# EAGLE design mainboard (EAGLE 6.1)

## Sheet 1 of 2
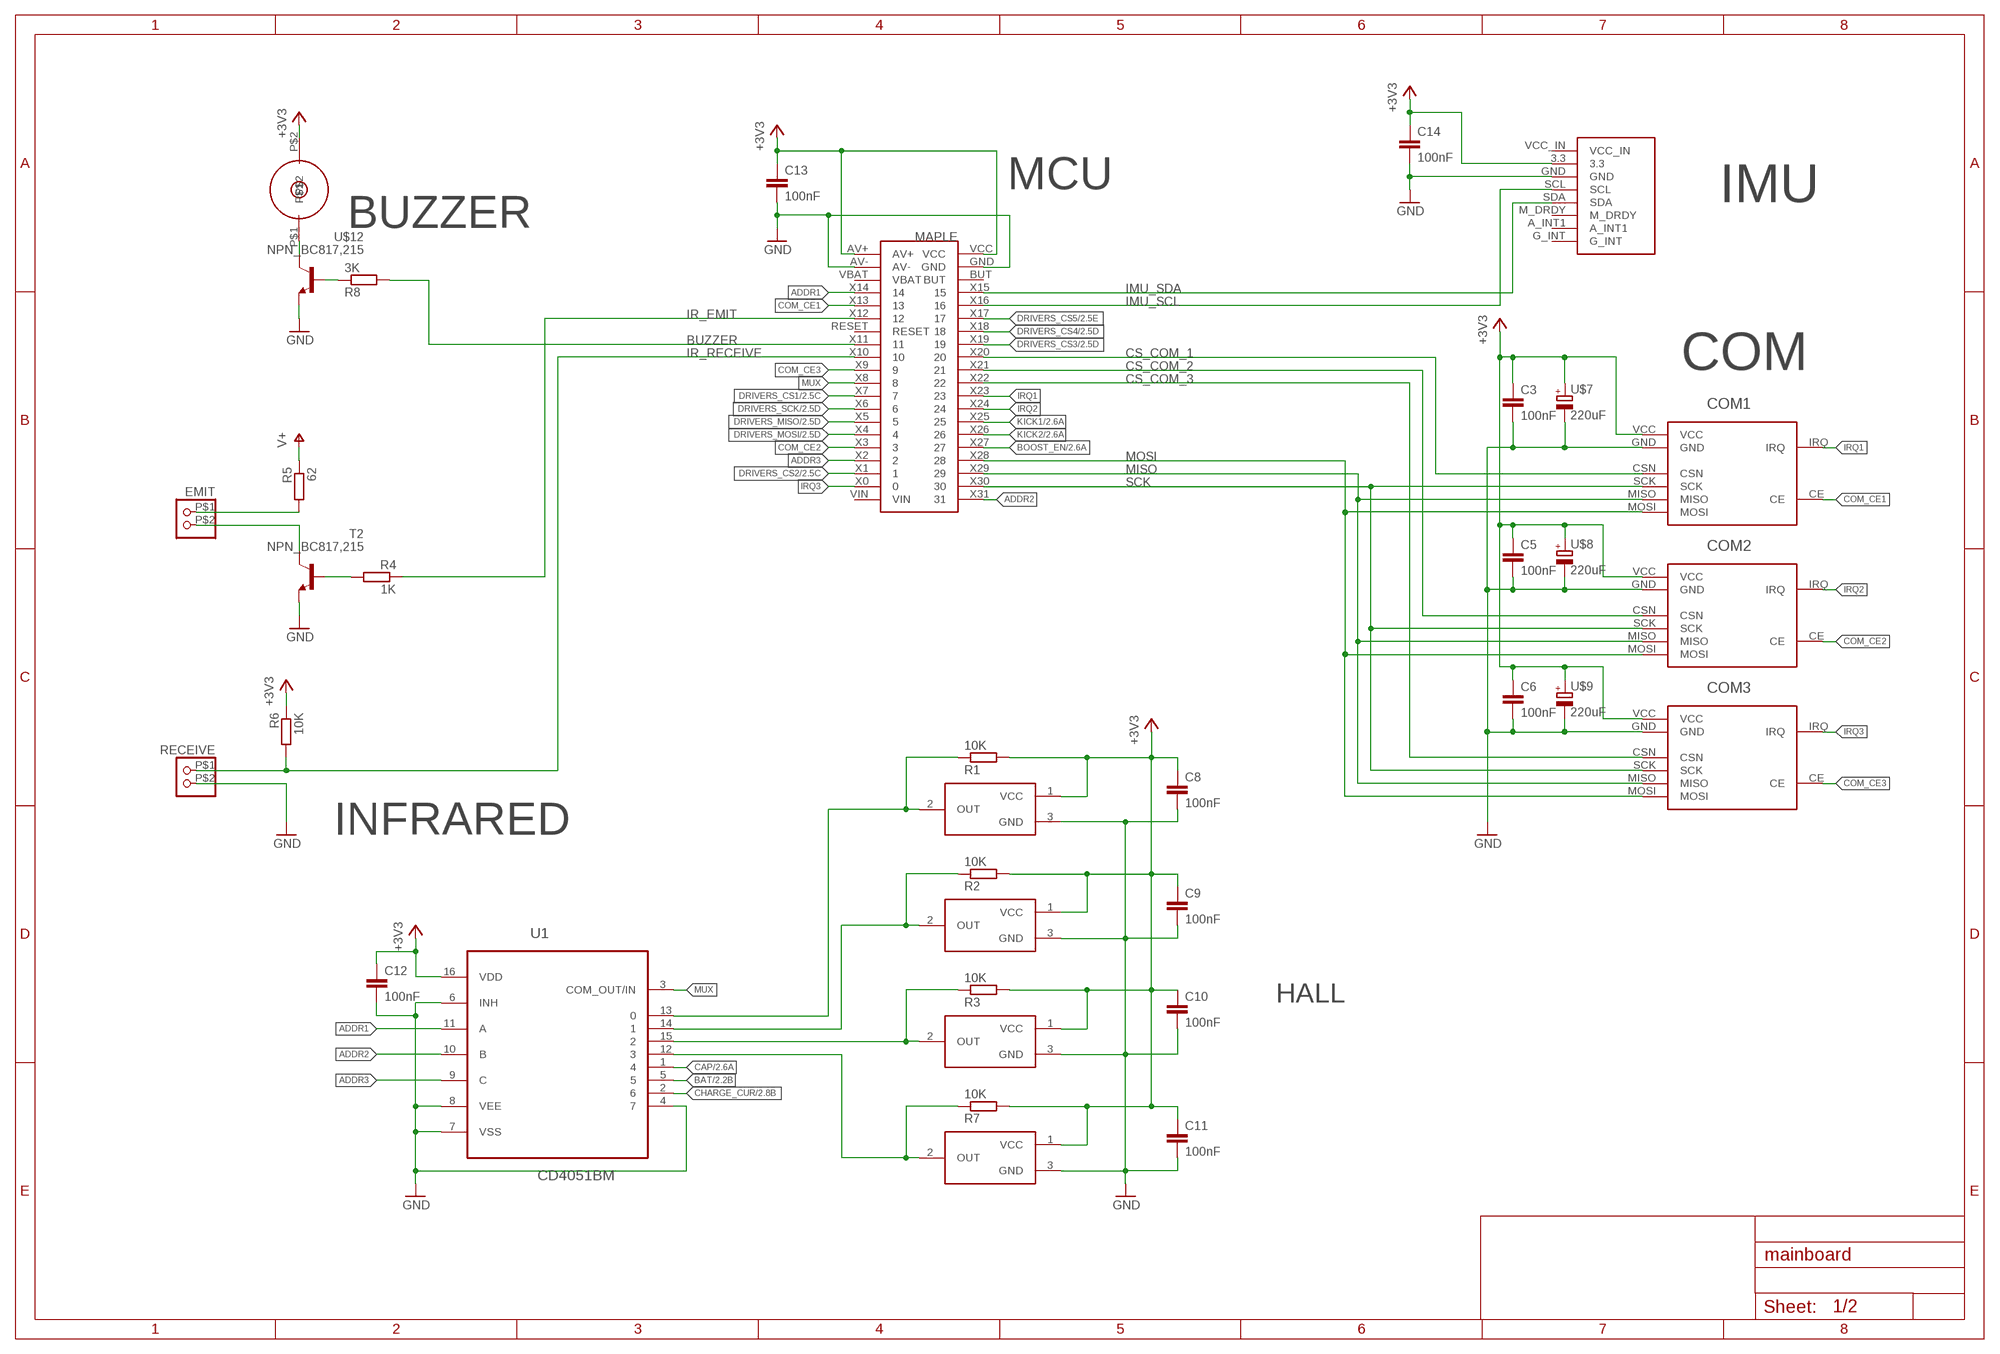
[diagram p0: schematic, sheet 1]

### Parts
C3  100nF  CAP0805  [0805@1]
C5  100nF  CAP0805  [0805@1]
C6  100nF  CAP0805  [0805@1]
C8  100nF  CAP0805  [0805@1]
C9  100nF  CAP0805  [0805@1]
C10  100nF  CAP0805  [0805@1]
C11  100nF  CAP0805  [0805@1]
C12  100nF  CAP0805  [0805@1]
C13  100nF  CAP0805  [0805@1]
C14  100nF  CAP0805  [0805@1]
COM1  NRF24L01  [NRF24L01]
COM2  NRF24L01  [NRF24L01]
COM3  NRF24L01  [NRF24L01]
EMIT  CONNEC_1X02JST-ZH  [JST_ZH_2P]
MAPLE  MAPLE_MINI  [CONNEC_2X20]
R1  10K  RESISTANCE-R0805  [R0805]
R2  10K  RESISTANCE-R0805  [R0805]
R3  10K  RESISTANCE-R0805  [R0805]
R4  1K  RESISTANCE-R0805  [R0805]
R5  62  RESISTANCE-R0805  [R0805]
R6  10K  RESISTANCE-R0805  [R0805]
R7  10K  RESISTANCE-R0805  [R0805]
R8  3K  R-EU_R0805  [R0805]
RECEIVE  CONNEC_1X02JST-ZH  [JST_ZH_2P]
T2  NPN_BC817,215  [SOT-23]
U1  CD4051BM  [SOIC127P600X175-16N]
U$1  DRV5023FAEDBZRQ1  [SOT-23]
U$2  GY-85  [GY-85]
U$5  DRV5023FAEDBZRQ1  [SOT-23]
U$7  220uF  CPOL_EUPANASONIC_D8  [PANASONIC_D8]
U$8  220uF  CPOL_EUPANASONIC_D8  [PANASONIC_D8]
U$9  220uF  CPOL_EUPANASONIC_D8  [PANASONIC_D8]
U$10  DRV5023FAEDBZRQ1  [SOT-23]
U$11  DRV5023FAEDBZRQ1  [SOT-23]
U$12  NPN_BC817,215  [SOT-23]
U$13  BUZZER66  [BUZZER66]

### Nets
+3V3: C3.1 C5.1 C6.1 C8.1 C9.1 C10.1 C11.1 C12.1 C13.1 C14.1 COM1.VCC COM2.VCC COM3.VCC MAPLE.AV+ MAPLE.VCC R1.2 R2.2 R3.2 R6.1 R7.2 U1.16(VDD) U$1.1(VCC) U$2.3.3 U$5.1(VCC) U$7.+ U$8.+ U$9.+ U$10.1(VCC) U$11.1(VCC) U$13.P$2 ; also sheet 2
ADDR1: MAPLE.X14 U1.11(A)
ADDR2: MAPLE.X31 U1.10(B)
ADDR3: MAPLE.X2 U1.9(C)
BAT: U1.5 ; also sheet 2
BOOST_EN: MAPLE.X27 ; also sheet 2
BUZZER: MAPLE.X11 R8.2
CAP: U1.1 ; also sheet 2
CHARGE_CUR: U1.2 ; also sheet 2
COM_CE1: COM1.CE MAPLE.X13
COM_CE2: COM2.CE MAPLE.X3
COM_CE3: COM3.CE MAPLE.X9
CS_COM_1: COM1.CSN MAPLE.X20
CS_COM_2: COM2.CSN MAPLE.X21
CS_COM_3: COM3.CSN MAPLE.X22
DRIVERS_CS1: MAPLE.X7 ; also sheet 2
DRIVERS_CS2: MAPLE.X1 ; also sheet 2
DRIVERS_CS3: MAPLE.X19 ; also sheet 2
DRIVERS_CS4: MAPLE.X18 ; also sheet 2
DRIVERS_CS5: MAPLE.X17 ; also sheet 2
DRIVERS_MISO: MAPLE.X5 ; also sheet 2
DRIVERS_MOSI: MAPLE.X4 ; also sheet 2
DRIVERS_SCK: MAPLE.X6 ; also sheet 2
GND [alim_big]: C3.2 C5.2 C6.2 C8.2 C9.2 C10.2 C11.2 C12.2 C13.2 C14.2 COM1.GND COM2.GND COM3.GND MAPLE.AV- MAPLE.GND RECEIVE.P$2 T2.2(E) U1.4 U1.6(INH) U1.7(VSS) U1.8(VEE) U$1.3(GND) U$2.GND U$5.3(GND) U$7.- U$8.- U$9.- U$10.3(GND) U$11.3(GND) U$12.2(E) ; also sheet 2
HALL1: R1.1 U1.13 U$1.2(OUT)
HALL2: R2.1 U1.14 U$5.2(OUT)
HALL3: R3.1 U1.15 U$10.2(OUT)
HALL4: R7.1 U1.12 U$11.2(OUT)
IMU_SCL: MAPLE.X16 U$2.SCL
IMU_SDA: MAPLE.X15 U$2.SDA
IR_EMIT: MAPLE.X12 R4.1
IR_RECEIVE: MAPLE.X10 R6.2 RECEIVE.P$1
IRQ1: COM1.IRQ MAPLE.X23
IRQ2: COM2.IRQ MAPLE.X24
IRQ3: COM3.IRQ MAPLE.X0
KICK1: MAPLE.X25 ; also sheet 2
KICK2: MAPLE.X26 ; also sheet 2
MISO: COM1.MISO COM2.MISO COM3.MISO MAPLE.X29
MOSI: COM1.MOSI COM2.MOSI COM3.MOSI MAPLE.X28
MUX: MAPLE.X8 U1.3(COM_OUT/IN)
N$3: R8.1 U$12.1(B)
N$5: U$12.3(C) U$13.P$1
N$6: EMIT.P$1 R5.2
N$7: EMIT.P$2 T2.3(C)
N$11: R4.2 T2.1(B)
SCK: COM1.SCK COM2.SCK COM3.SCK MAPLE.X30
V+ [alim_small]: R5.1 ; also sheet 2
Unconnected: MAPLE.BUT MAPLE.RESET MAPLE.VBAT MAPLE.VIN U$2.A_INT1 U$2.G_INT U$2.M_DRDY U$2.VCC_IN

### Notes on the sheet
- MCU | IMU
- BUZZER
- COM
- INFRARED
- HALL

## Sheet 2 of 2
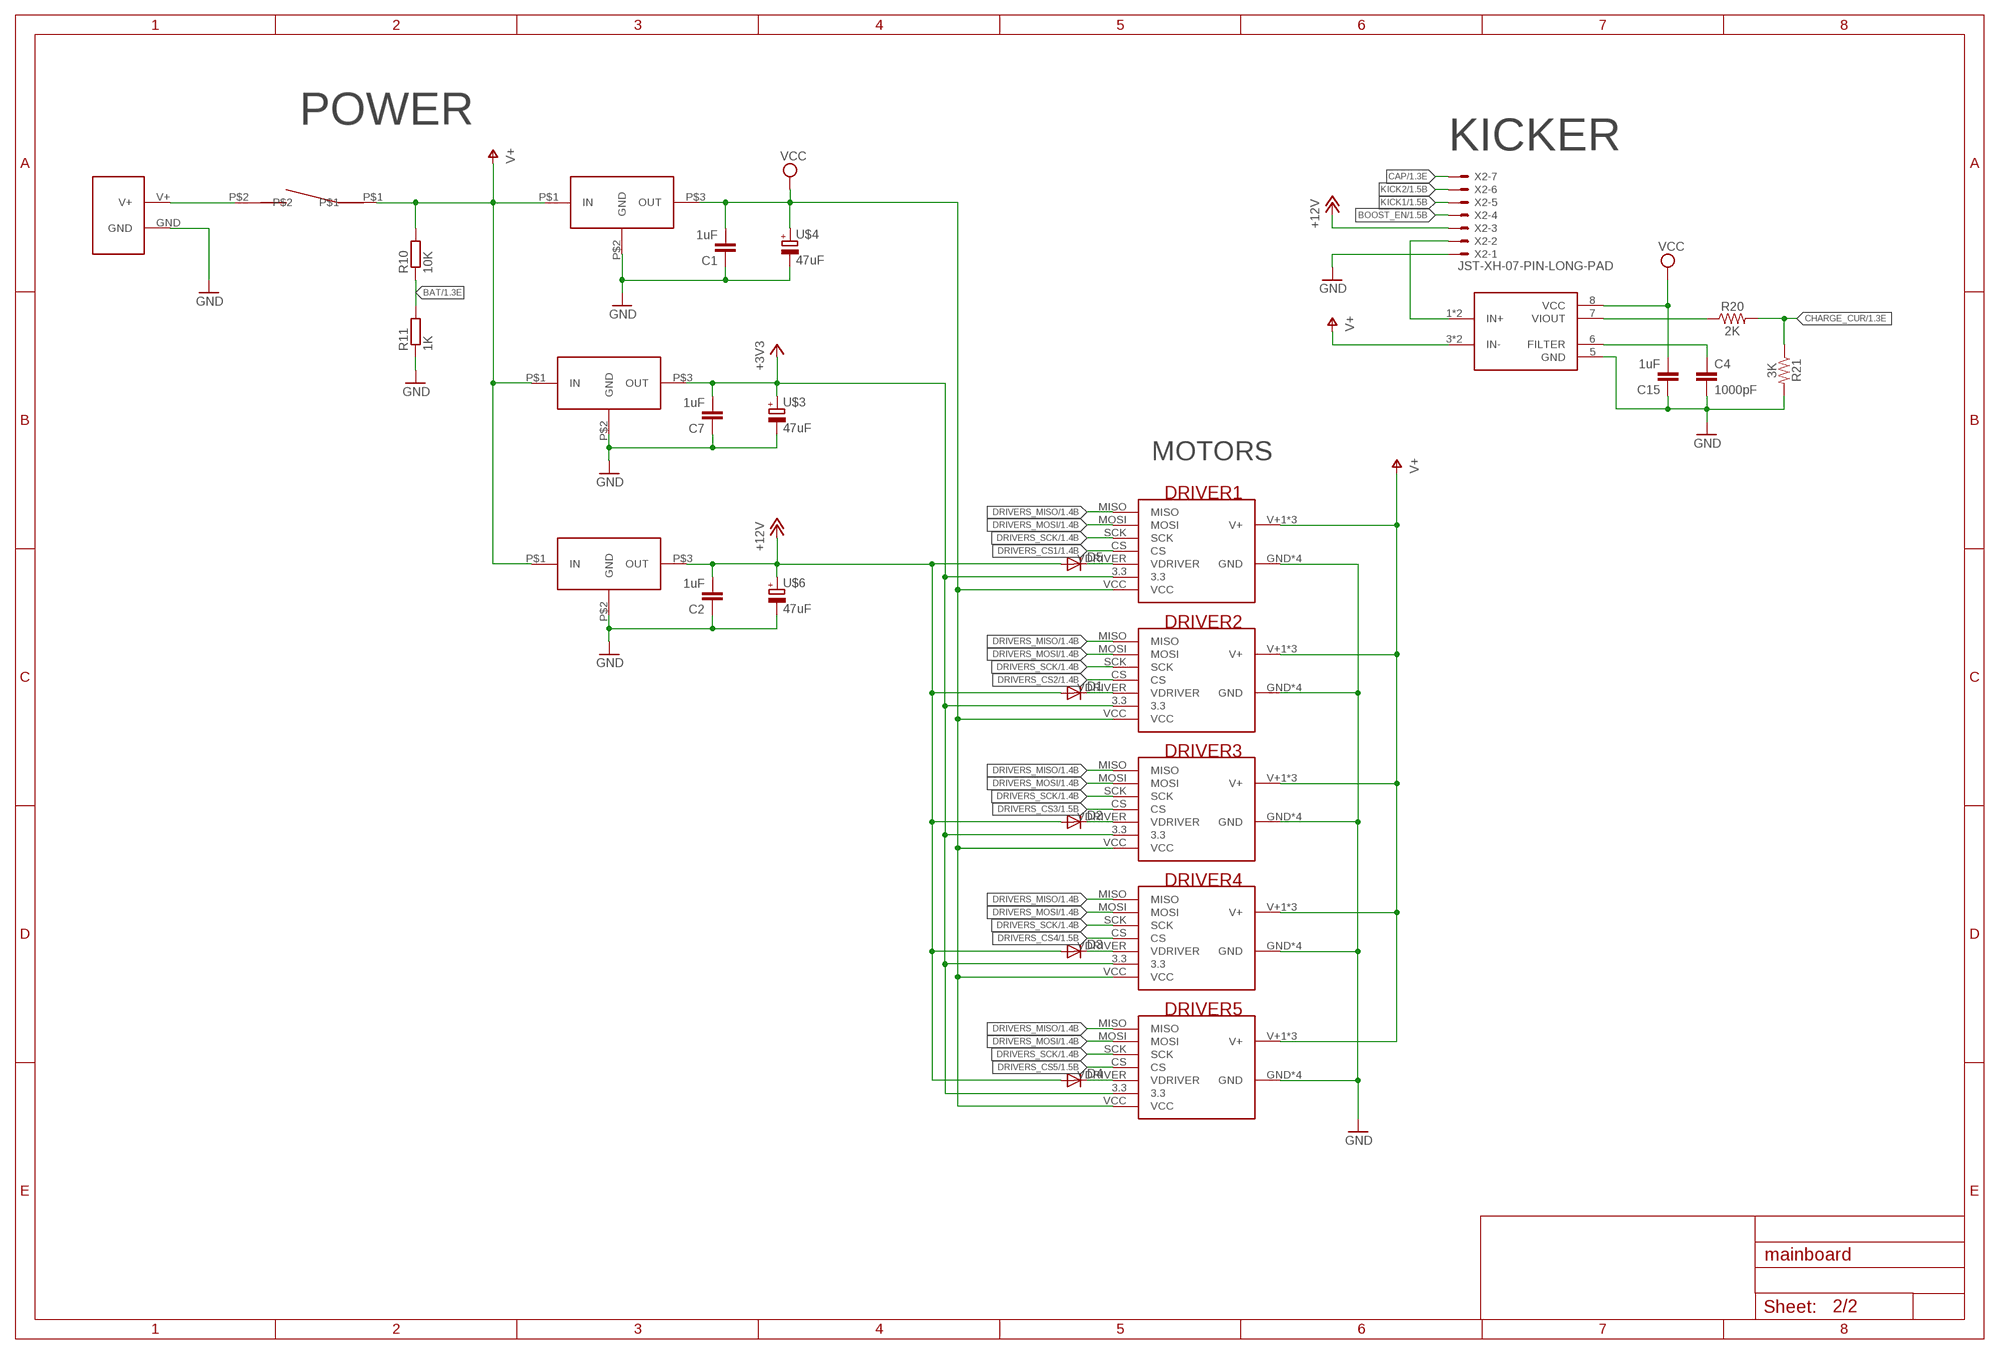
[diagram p1: schematic, sheet 2]

### Parts
C1  1uF  CAP0805  [0805@1]
C2  1uF  CAP0805  [0805@1]
C4  1000pF  CAP0805  [0805@1]
C7  1uF  CAP0805  [0805@1]
C15  1uF  CAP0805  [0805@1]
D1  DIODESOD  [SOD-323]
D2  DIODESOD  [SOD-323]
D3  DIODESOD  [SOD-323]
D4  DIODESOD  [SOD-323]
D5  DIODESOD  [SOD-323]
DRIVER1  RHOBAN_BL_DRIVER  [RHOBAN_BL_DRIVER]
DRIVER2  RHOBAN_BL_DRIVER  [RHOBAN_BL_DRIVER]
DRIVER3  RHOBAN_BL_DRIVER  [RHOBAN_BL_DRIVER]
DRIVER4  RHOBAN_BL_DRIVER  [RHOBAN_BL_DRIVER]
DRIVER5  RHOBAN_BL_DRIVER  [RHOBAN_BL_DRIVER]
R10  10K  RESISTANCE-R0805  [R0805]
R11  1K  RESISTANCE-R0805  [R0805]
R20  2K  RESISTOR0805  [0805]
R21  3K  RESISTOR0805  [0805]
REG3.3V  REG_5V  [TRACOPOWER]
REG3.3V1  REG_5V  [TRACOPOWER]
REG5V  REG_5V  [TRACOPOWER]
SENSE  ACS712  [SO8]
U$3  47uF  CPOL_EUPANASONIC_D  [PANASONIC_D]
U$4  47uF  CPOL_EUPANASONIC_D  [PANASONIC_D]
U$6  47uF  CPOL_EUPANASONIC_D  [PANASONIC_D]
U$15  SRB22A2FBBNN  [SRB22A2FBBNN]
X2  JST-XH-07-PIN-LONG-PAD  [JST-XH-07-PACKAGE-LONG-PAD]
XT60  CONNEC_ALIM  [XT60]

### Nets
+3V3: C7.2 DRIVER1.3.3 DRIVER2.3.3 DRIVER3.3.3 DRIVER4.3.3 DRIVER5.3.3 REG3.3V.P$3(OUT) U$3.+ ; also sheet 1
+12V: C2.2 D1.2(A) D2.2(A) D3.2(A) D4.2(A) D5.2(A) REG3.3V1.P$3(OUT) U$6.+ X2.3
BAT: R10.1 R11.2 ; also sheet 1
BOOST_EN: X2.4 ; also sheet 1
CAP: X2.7 ; also sheet 1
CHARGE_CUR: R20.2 R21.1 ; also sheet 1
DRIVERS_CS1: DRIVER1.CS ; also sheet 1
DRIVERS_CS2: DRIVER2.CS ; also sheet 1
DRIVERS_CS3: DRIVER3.CS ; also sheet 1
DRIVERS_CS4: DRIVER4.CS ; also sheet 1
DRIVERS_CS5: DRIVER5.CS ; also sheet 1
DRIVERS_MISO: DRIVER1.MISO DRIVER2.MISO DRIVER3.MISO DRIVER4.MISO DRIVER5.MISO ; also sheet 1
DRIVERS_MOSI: DRIVER1.MOSI DRIVER2.MOSI DRIVER3.MOSI DRIVER4.MOSI DRIVER5.MOSI ; also sheet 1
DRIVERS_SCK: DRIVER1.SCK DRIVER2.SCK DRIVER3.SCK DRIVER4.SCK DRIVER5.SCK ; also sheet 1
GND [alim_big]: C1.1 C2.1 C4.2 C7.1 C15.1 DRIVER1.GND DRIVER1.GND2(GND) DRIVER1.GND3(GND) DRIVER1.GND4(GND) DRIVER2.GND DRIVER2.GND2(GND) DRIVER2.GND3(GND) DRIVER2.GND4(GND) DRIVER3.GND DRIVER3.GND2(GND) DRIVER3.GND3(GND) DRIVER3.GND4(GND) DRIVER4.GND DRIVER4.GND2(GND) DRIVER4.GND3(GND) DRIVER4.GND4(GND) DRIVER5.GND DRIVER5.GND2(GND) DRIVER5.GND3(GND) DRIVER5.GND4(GND) R11.1 R21.2 REG3.3V1.P$2(GND) REG3.3V.P$2(GND) REG5V.P$2(GND) SENSE.5(GND) U$3.- U$4.- U$6.- X2.1 XT60.GND ; also sheet 1
KICK1: X2.5 ; also sheet 1
KICK2: X2.6 ; also sheet 1
N$1: U$15.P$2 XT60.V+
N$2: C4.1 SENSE.6(FILTER)
N$4: SENSE.1(IN+) SENSE.2(IN+) X2.2
N$8: D5.1(C) DRIVER1.VDRIVER
N$9: D3.1(C) DRIVER4.VDRIVER
N$10: D4.1(C) DRIVER5.VDRIVER
N$12: D2.1(C) DRIVER3.VDRIVER
N$13: D1.1(C) DRIVER2.VDRIVER
N$24: R20.1 SENSE.7(VIOUT)
V+ [alim_small]: DRIVER1.V+1(V+) DRIVER1.V+2(V+) DRIVER1.V+3(V+) DRIVER2.V+1(V+) DRIVER2.V+2(V+) DRIVER2.V+3(V+) DRIVER3.V+1(V+) DRIVER3.V+2(V+) DRIVER3.V+3(V+) DRIVER4.V+1(V+) DRIVER4.V+2(V+) DRIVER4.V+3(V+) DRIVER5.V+1(V+) DRIVER5.V+2(V+) DRIVER5.V+3(V+) R10.2 REG3.3V1.P$1(IN) REG3.3V.P$1(IN) REG5V.P$1(IN) SENSE.3(IN-) SENSE.4(IN-) U$15.P$1 ; also sheet 1
VCC [alim_small]: C1.2 C15.2 DRIVER1.VCC DRIVER2.VCC DRIVER3.VCC DRIVER4.VCC DRIVER5.VCC REG5V.P$3(OUT) SENSE.8(VCC) U$4.+

### Notes on the sheet
- POWER
- KICKER
- MOTORS

## Library data of the parts
C1-C3 C5-C15 = SparkFun-Passives:CAP: Capacitor Standard 0603 ceramic capacitor, and 0.1" leaded capacitor.; FARNELL: 2496946
C4 = SparkFun-Passives:CAP: Capacitor Standard 0603 ceramic capacitor, and 0.1" leaded capacitor.; FARNELL: 2496935
COM1-COM3 = rhoban:NRF24L01; FARNELL: 1668343
D1-D5 = SparkFun-DiscreteSemi:DIODE: Diode These are standard reverse protection diodes and small signal diodes. SMA package can handle up to about 1A. SOD-323 can handle about 200mA. What the SOD-323 package when ordering, there are some mfgs out there that are 5-pin packages.; FARNELL: 8737843RL
DRIVER1-DRIVER5 = rhoban:RHOBAN_BL_DRIVER; FARNELL: 1593459,1593459,1593463
EMIT = rhoban:CONNEC_1X02; FARNELL: 1212763
MAPLE = rhoban:MAPLE_MINI; FARNELL: 1593469,1593469
R1-R3 R6 R7 R10 = rhoban:RESISTANCE: RESISTOR, European symbol; FARNELL: 2447553
R4 R11 = rhoban:RESISTANCE: RESISTOR, European symbol; FARNELL: 2446904
R5 = rhoban:RESISTANCE: RESISTOR, European symbol; FARNELL: 2138819
R8 = rcl:R-EU_: RESISTOR, European symbol; FARNELL: 2446965
R20 = SparkFun-Resistors:RESISTOR: Generic Resistor Package; FARNELL: 2446939
R21 = SparkFun-Resistors:RESISTOR: Generic Resistor Package; FARNELL: 2446965
RECEIVE = rhoban:CONNEC_1X02; FARNELL: 3152856
REG3.3V = rhoban:REG_5V; FARNELL: 1696319
REG3.3V1 = rhoban:REG_5V; FARNELL: 1672130
REG5V = rhoban:REG_5V; FARNELL: 1696320
SENSE = rhoban:ACS712; FARNELL: 1329623
T2 U$12 = rhoban:NPN; FARNELL: 1081223
U1 = rhoban:CD4051BM: CMOS Analog Multiplexers/Demultiplexers with Logic Level Conversion; FARNELL: 2334931; MPN: CD4051BM; OC_FARNELL: 8388970; OC_NEWARK: 05B5595; PACKAGE: SOIC-16; SUPPLIER: Texas Instruments
U$1 U$5 U$10 U$11 = rhoban:DRV5023FAEDBZRQ1; FARNELL: 2673327RL
U$2 = rhoban:GY-85; FARNELL: 1593463
U$3 U$4 U$6 = rhoban:CPOL_EU: 47uF: http://fr.farnell.com/panasonic-electronic-components/eee1ca470sp/condensateur-elec-alu-47uf-16v/dp/9696946 220uF: http://fr.farnell.com/panasonic-electronic-components/eeefk1c221xp/condensateur-elec-alu-220uf-16v/dp/1850103; FARNELL: 9696946
U$7-U$9 = rhoban:CPOL_EU: 47uF: http://fr.farnell.com/panasonic-electronic-components/eee1ca470sp/condensateur-elec-alu-47uf-16v/dp/9696946 220uF: http://fr.farnell.com/panasonic-electronic-components/eeefk1c221xp/condensateur-elec-alu-220uf-16v/dp/1850103; FARNELL: 1850103
U$13 = rhoban:BUZZER; FARNELL: -
U$15 = rhoban:SRB22A2FBBNN; FARNELL: 1383947
X2 = Rembrandt Electronics - JST XH Connectors v1-0:JST-XH-07-PIN: JST XH Connector 2 Pin Wire to board connector. Pitch: 2,54 mm, (0.100") Number of pins: 7 Created by Rembrandt Electronics www.rembrandtelectronics.com
XT60 = rhoban:CONNEC_ALIM; FARNELL: -

## Net classes
0 default: width 0.254 mm
1 alim_small: width 0.508 mm
2 alim_big: width 0.508 mm
3 alim_very_big: width 0.508 mm

## Board
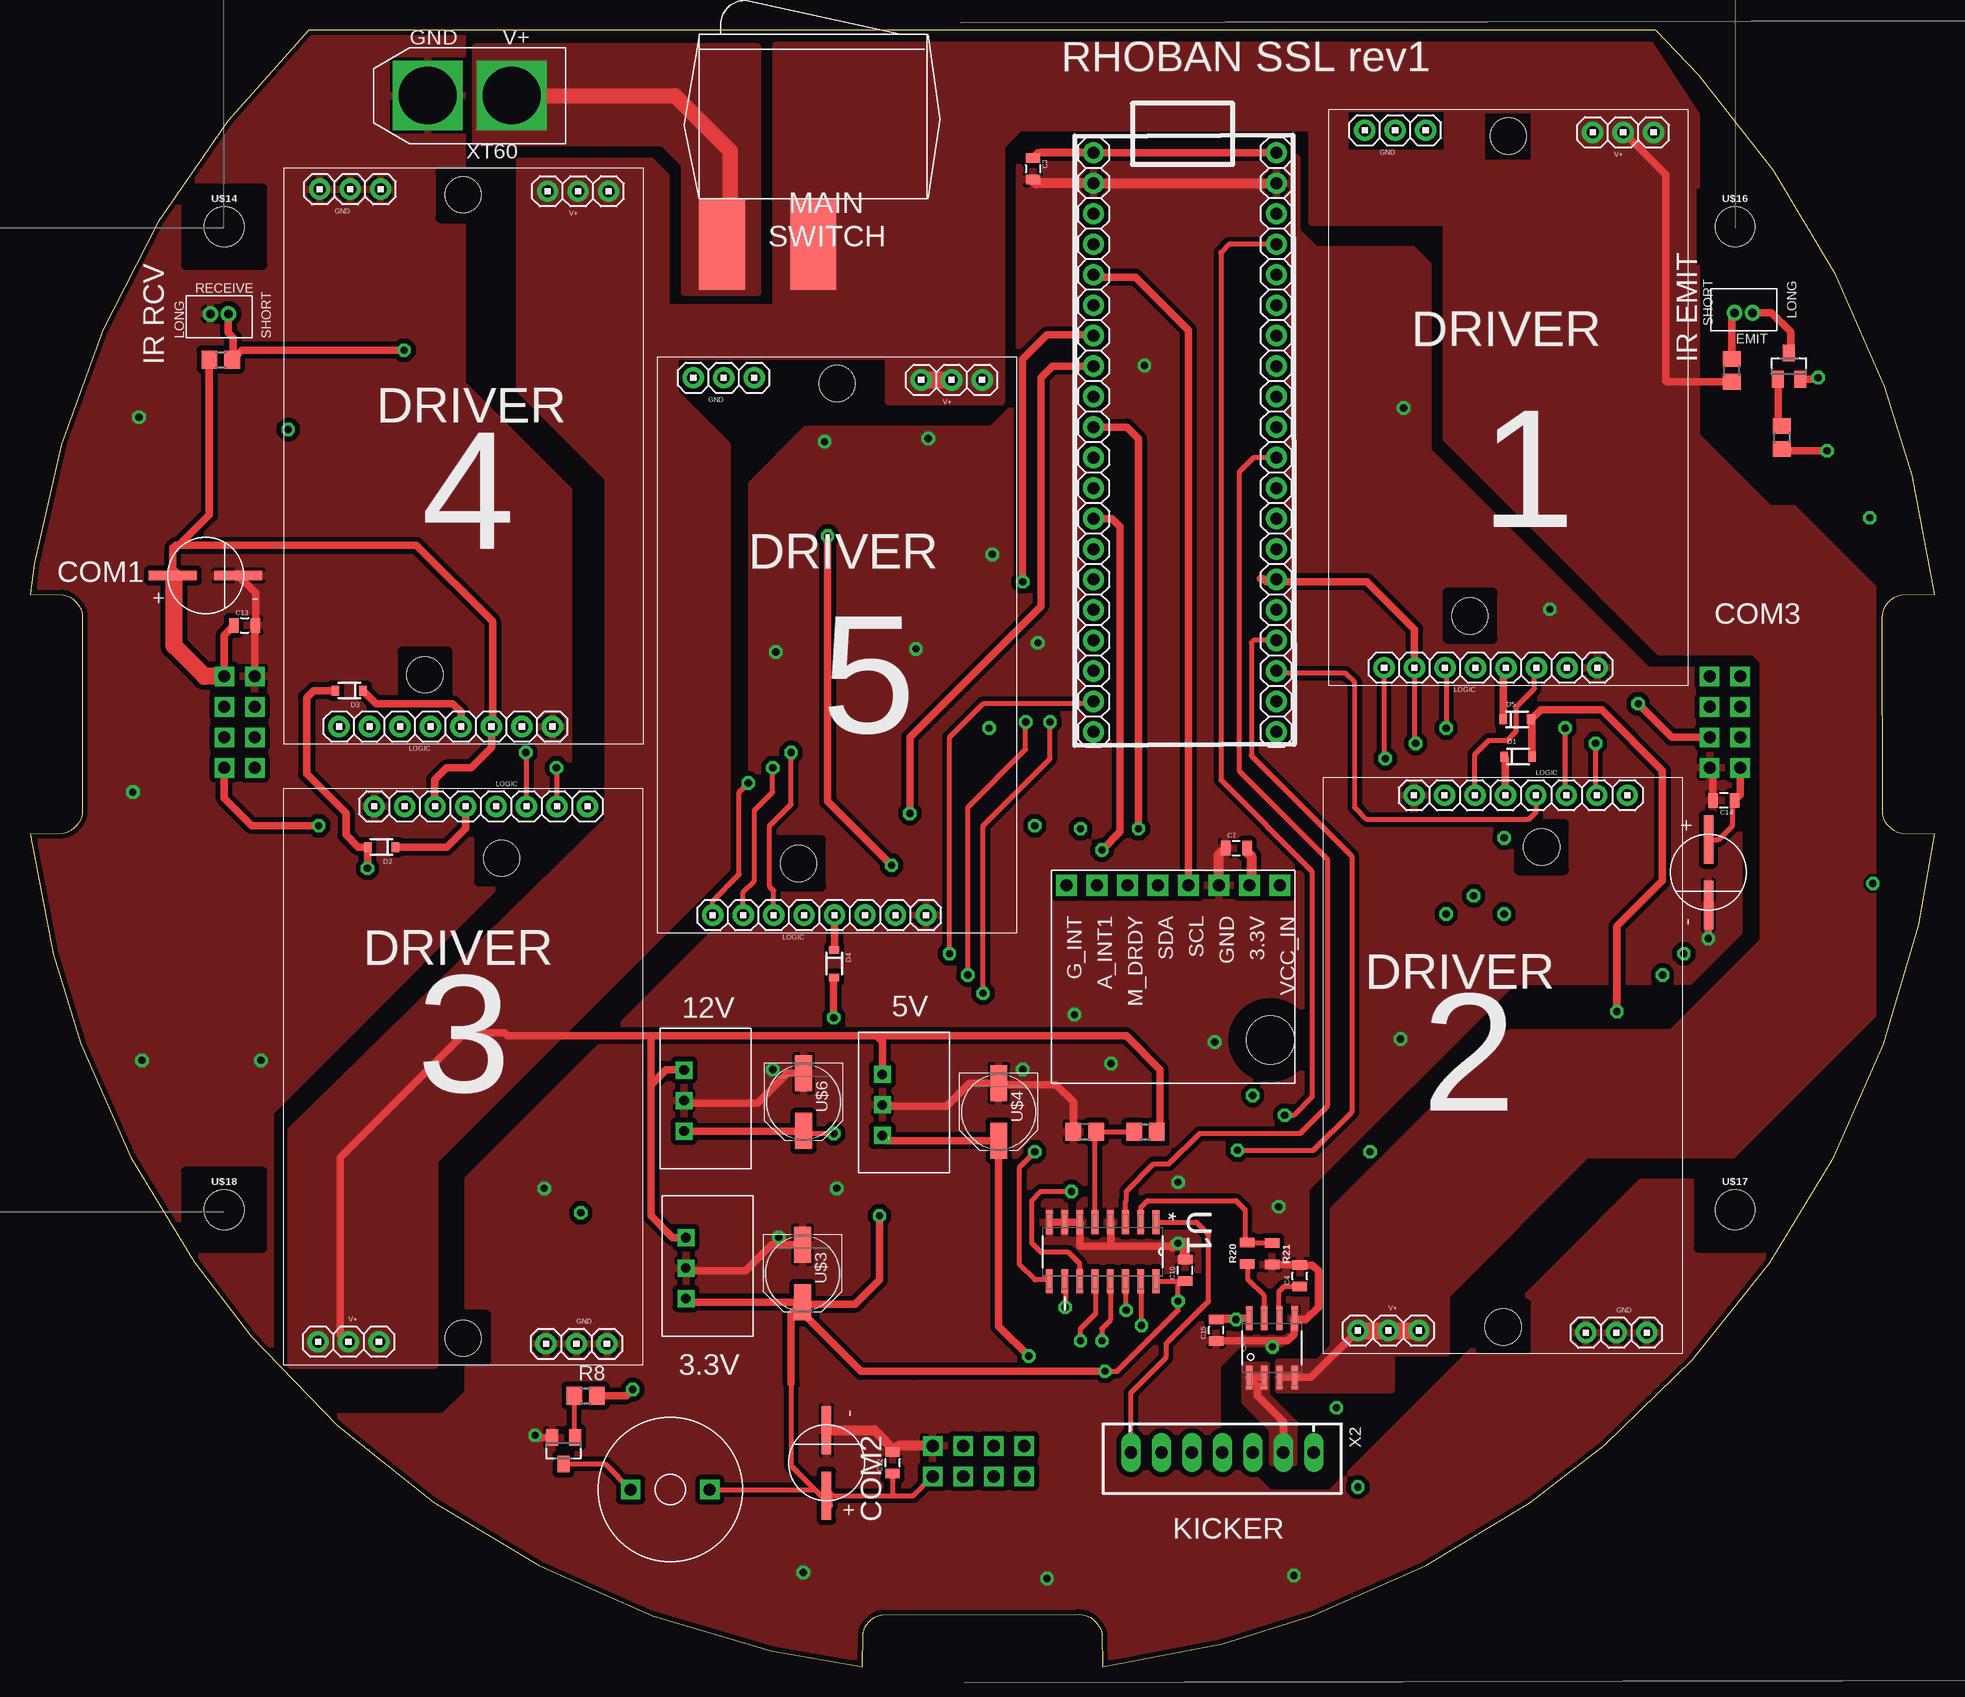
[diagram p2: board, top side]
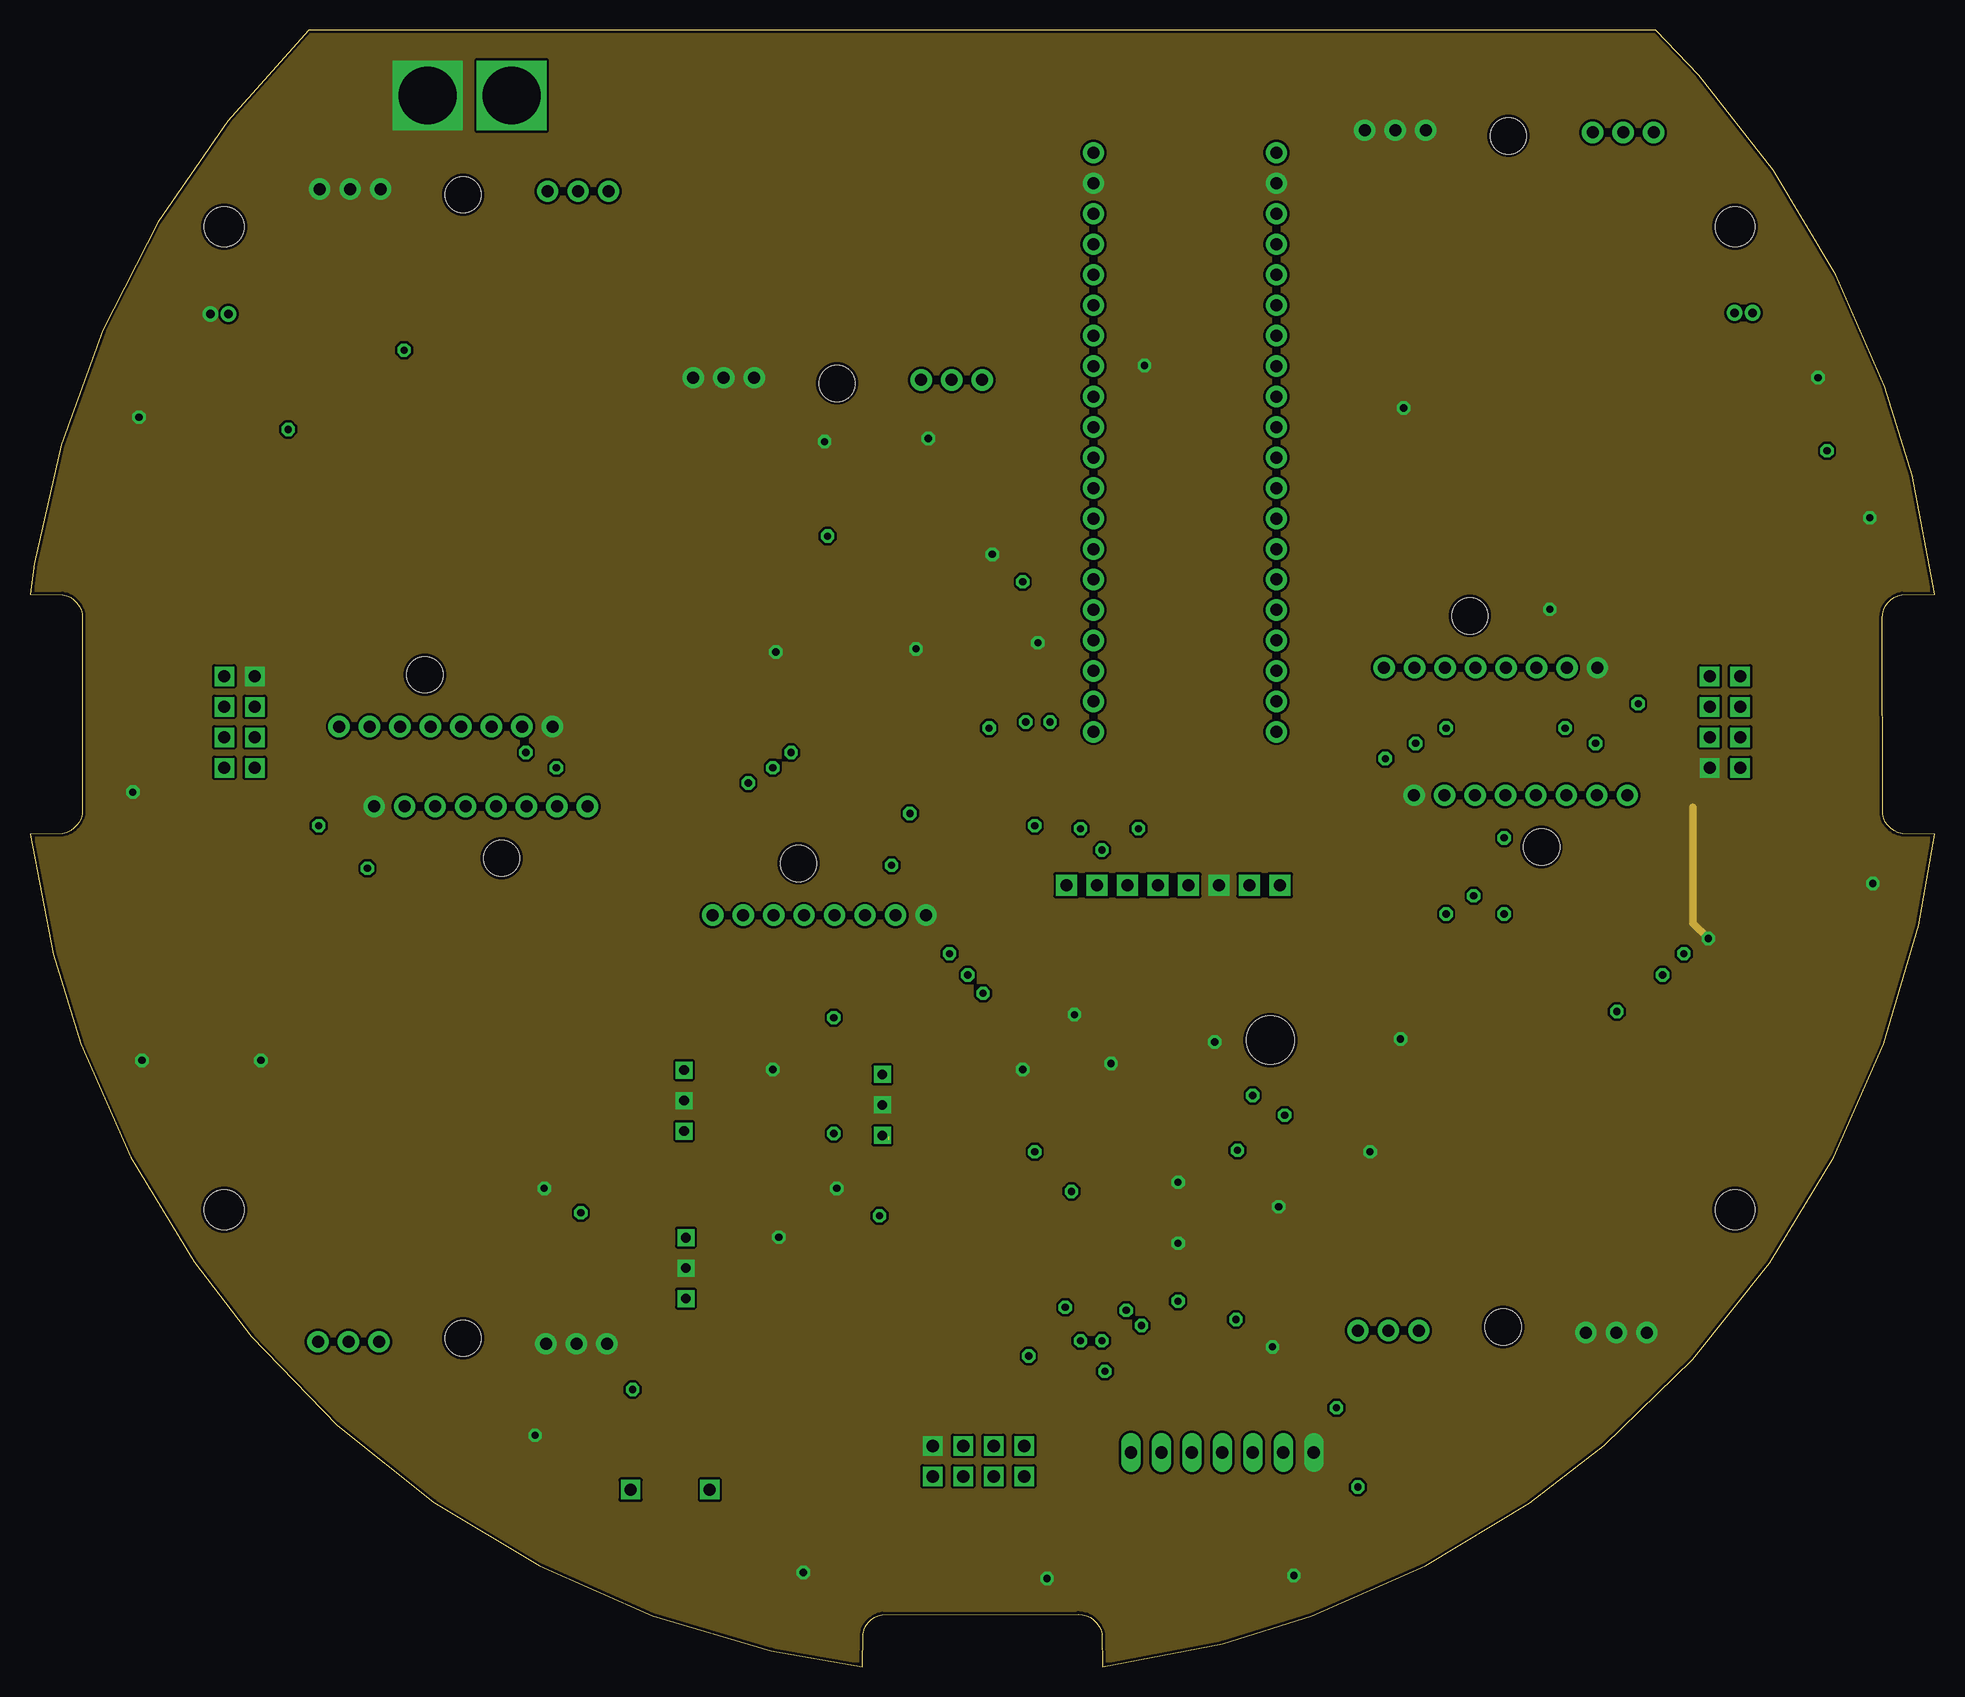
[diagram p3: board, inner layer Route2]
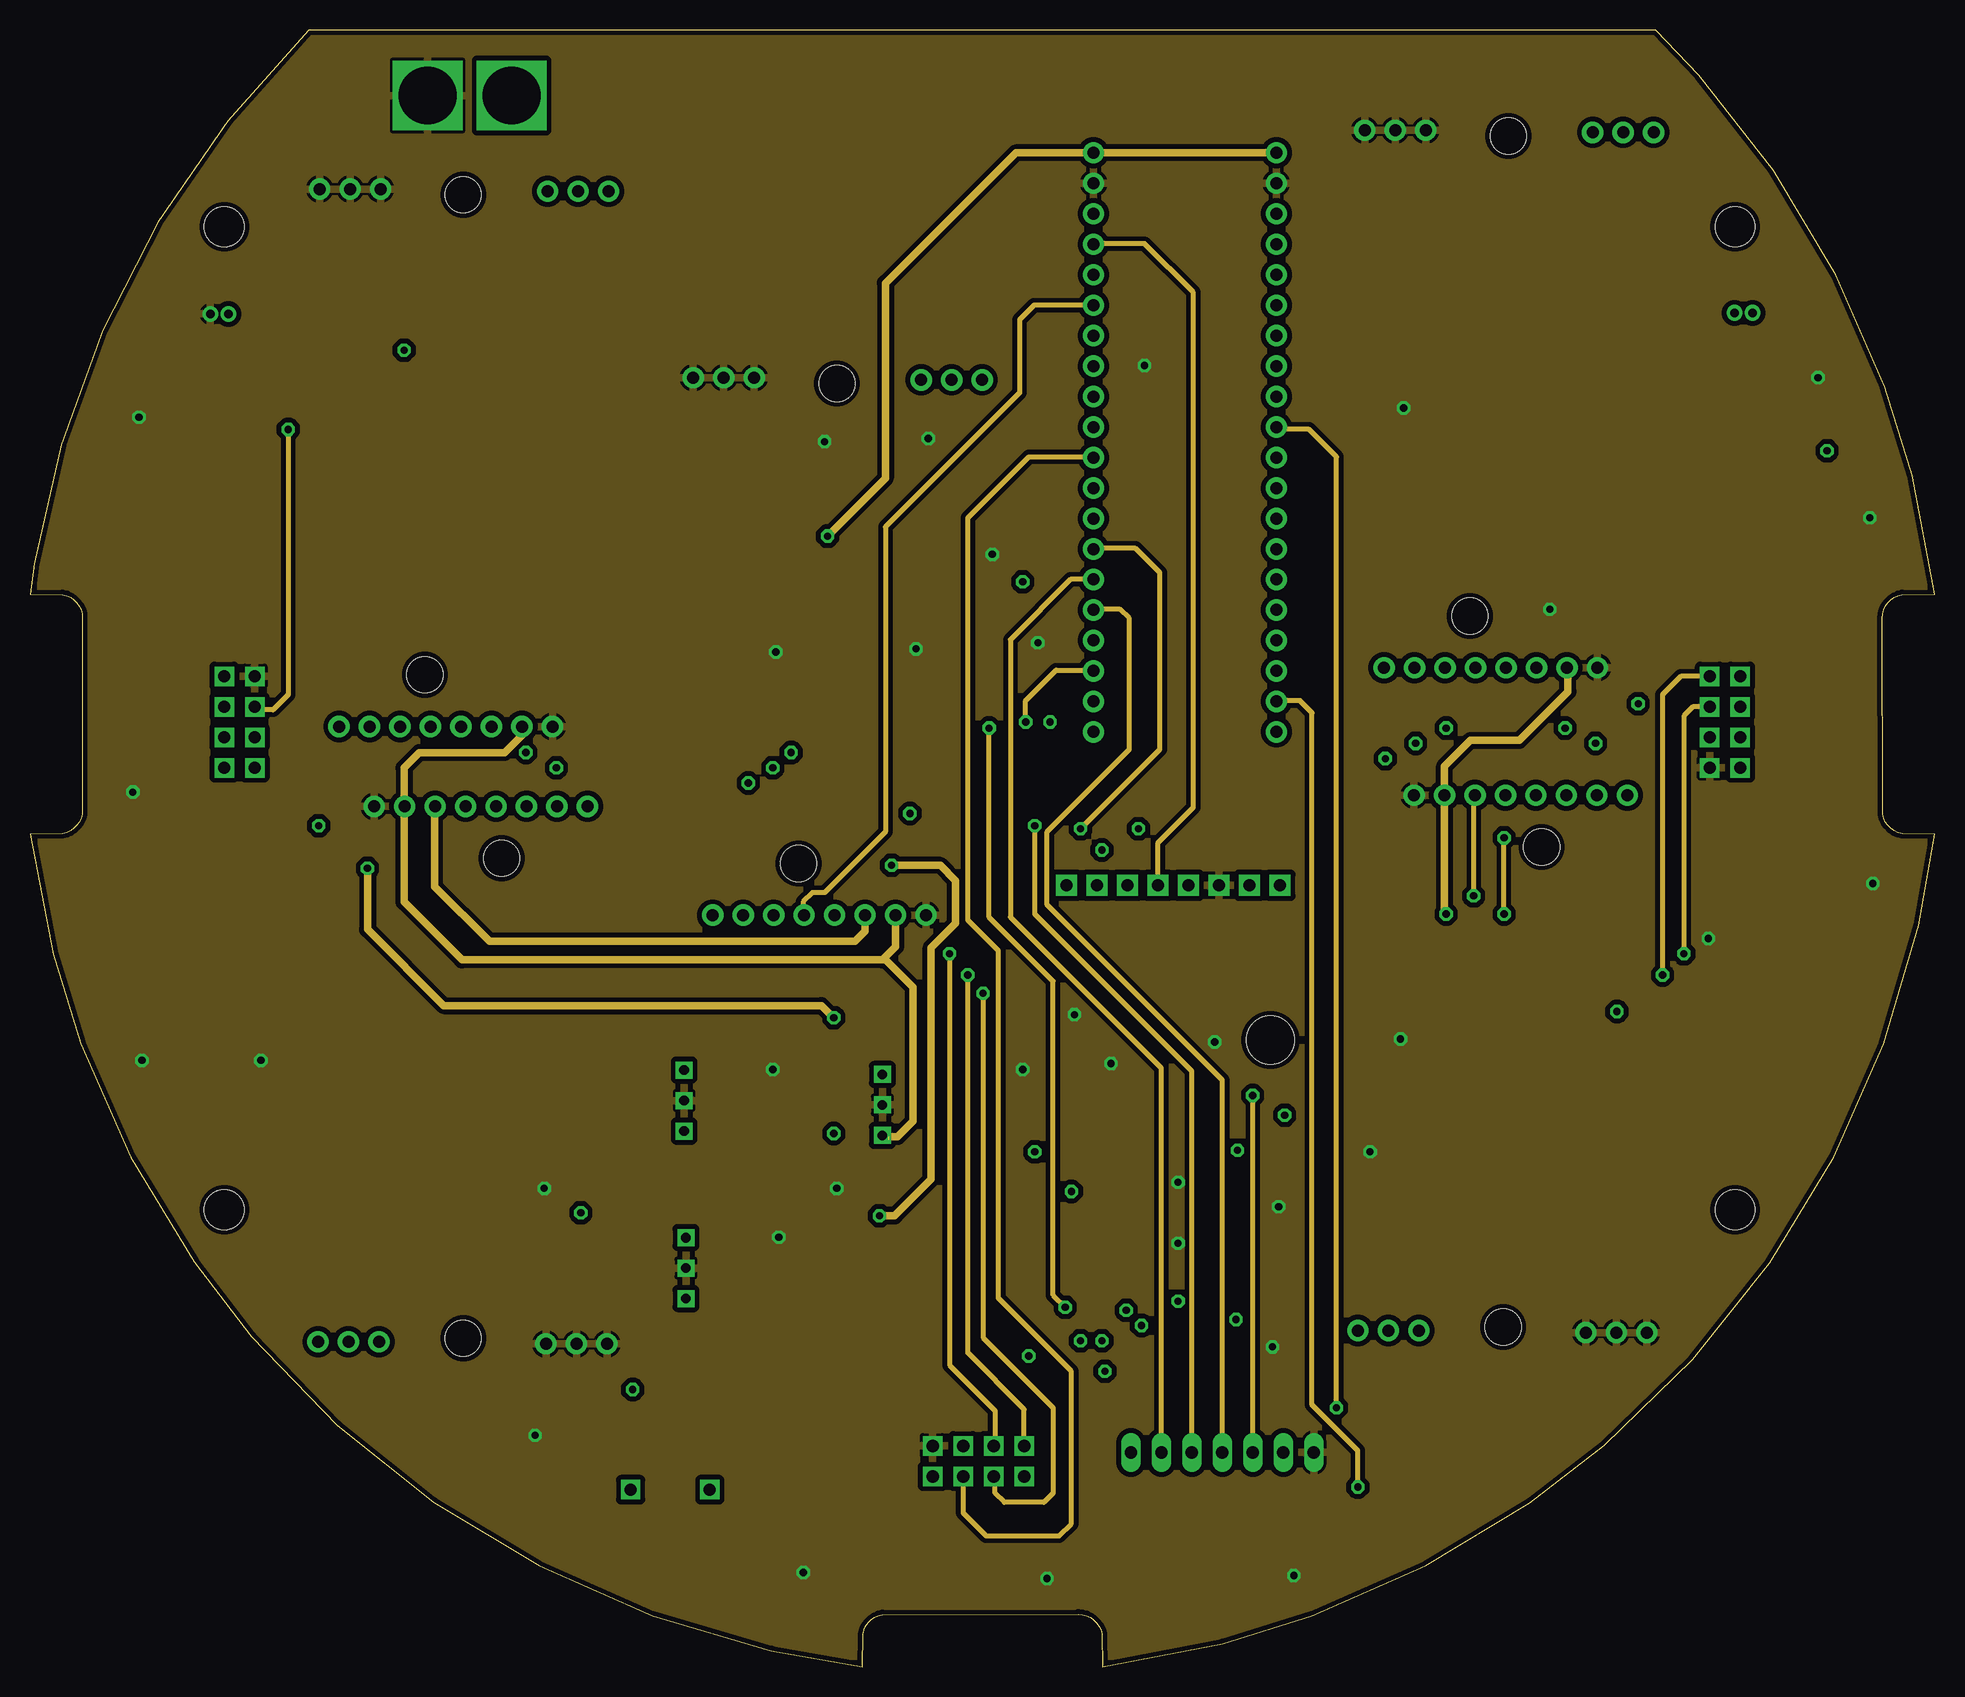
[diagram p4: board, inner layer Route15]
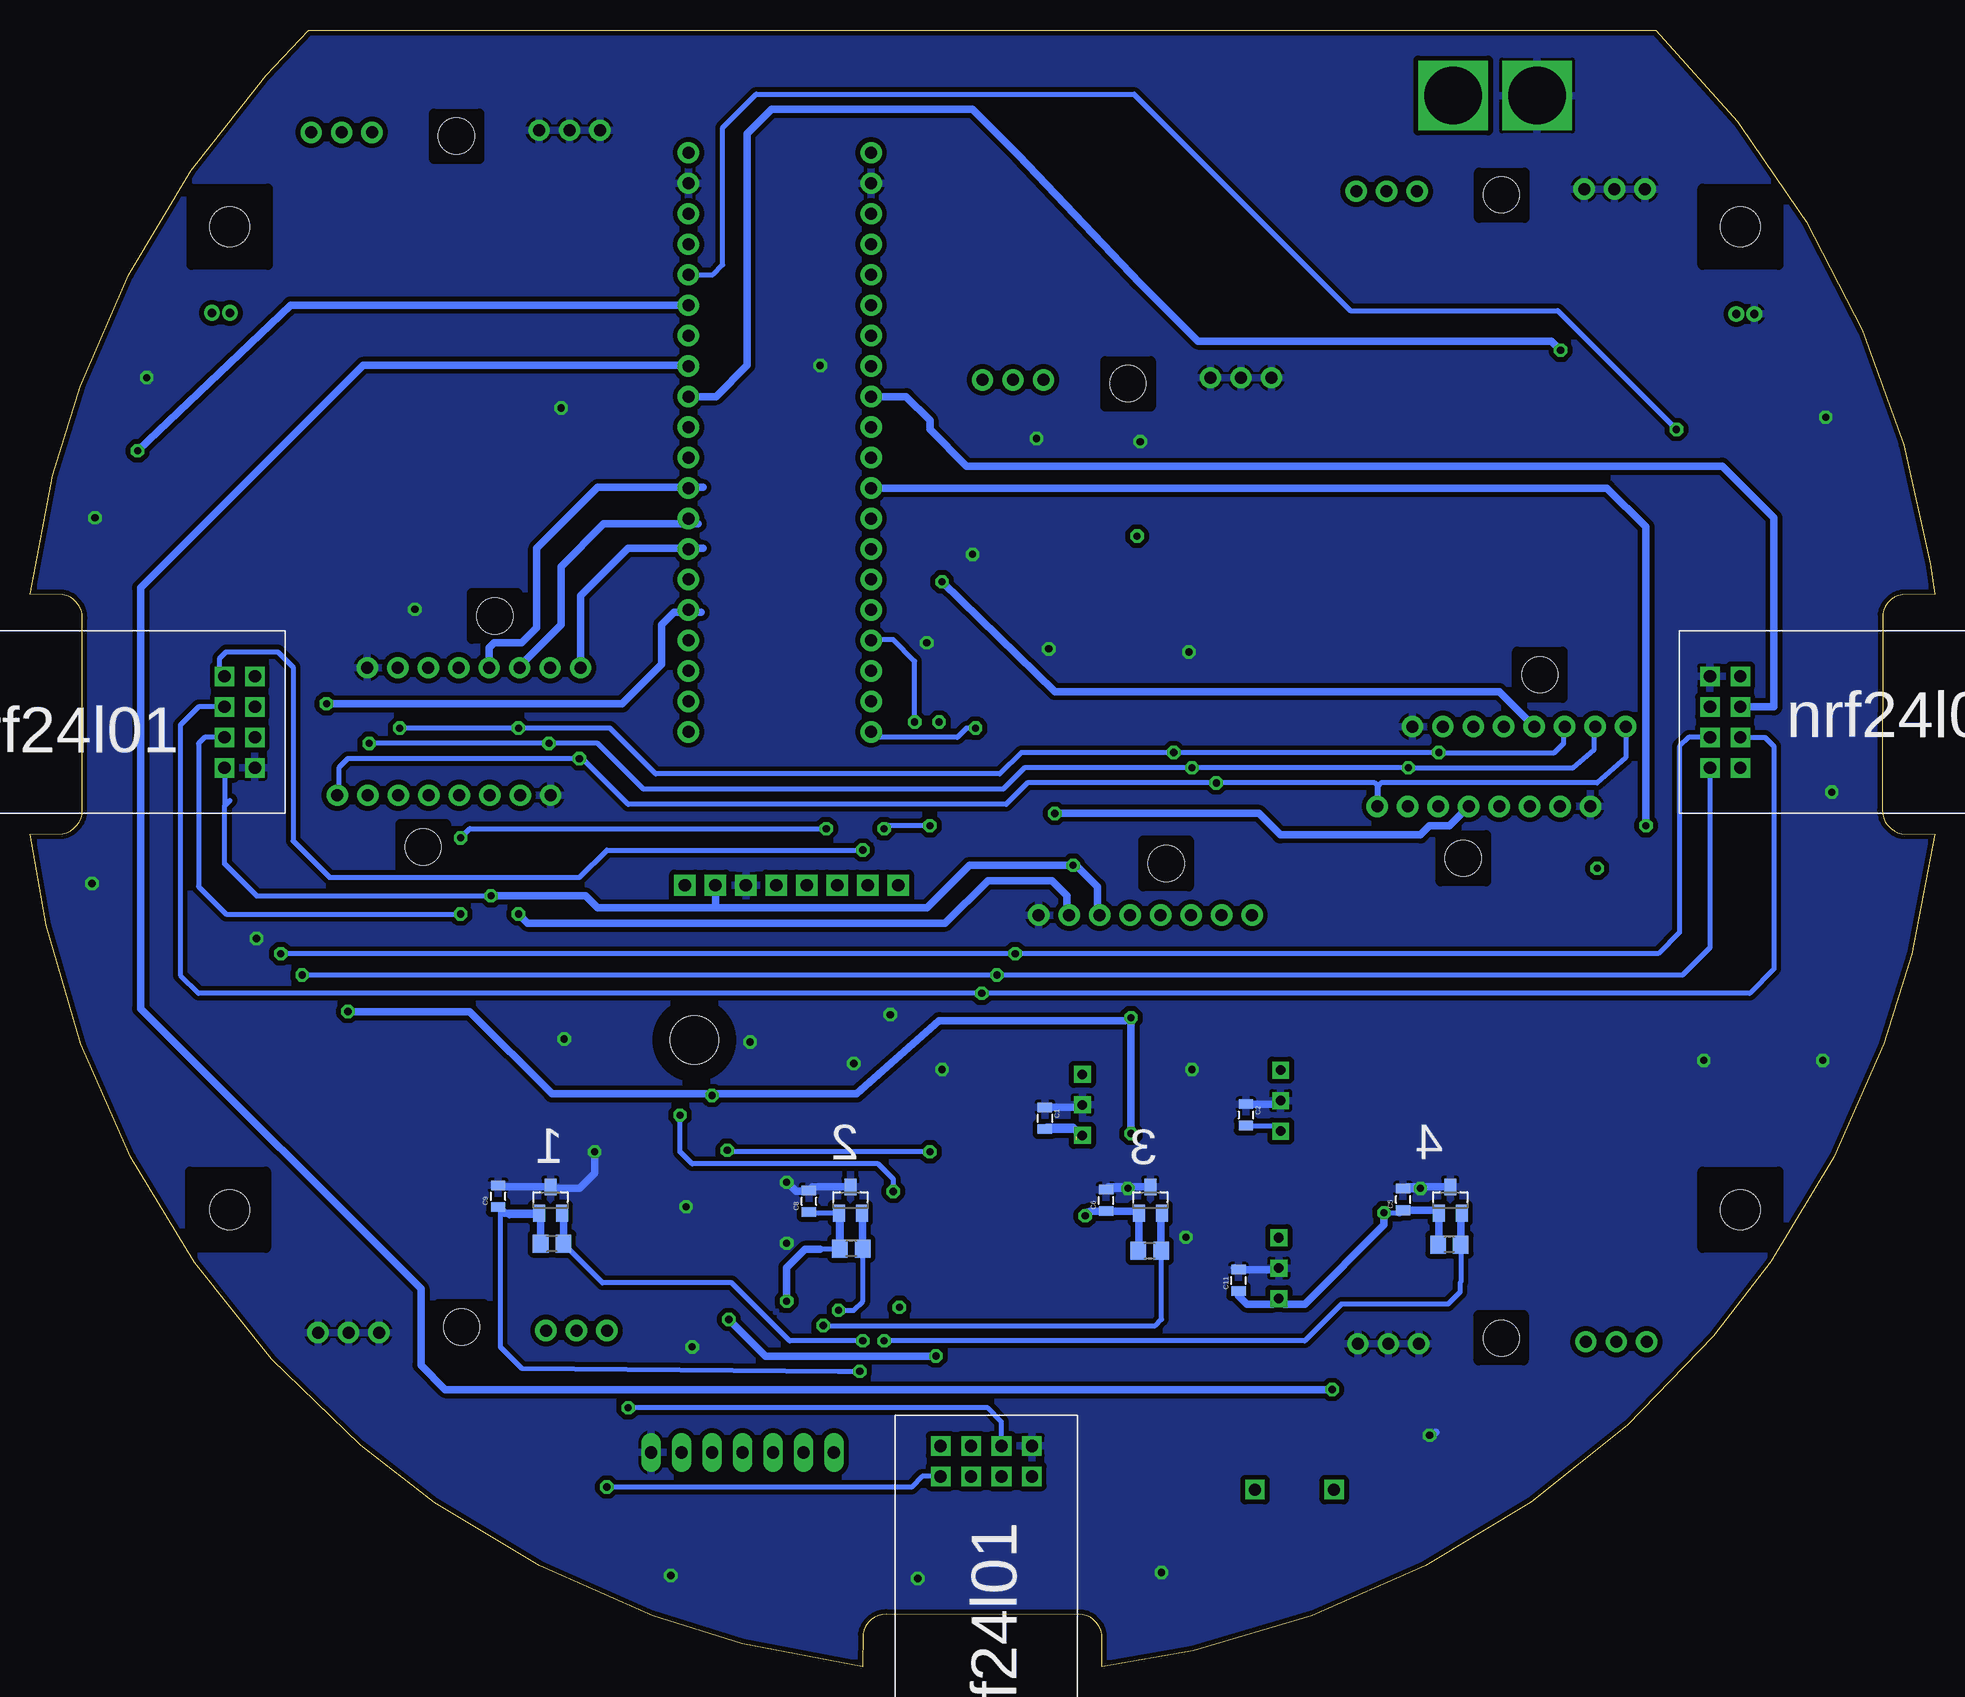
[diagram p5: board, bottom side, seen from below]

Size 158.77 x 136.39 mm. Coordinates in mm from the lower left corner, seen from the top.
Outline: 88.66,3.91 88.91,3.66 89.11,3.38 89.25,3.07 89.34,2.73 89.38,0 99.41,1.92 106.87,4.24 116.3,8.4 125.04,13.68 131.23,18.44 138.62,25.61 145.04,33.66 150.37,42.47 154.52,51.9 157.43,61.77 158.77,69.39 156.05,69.42 155.71,69.51 155.71,69.51 155.7,69.51 155.39,69.66 155.1,69.86 154.86,70.11 154.66,70.39 154.51,70.7 154.42,71.04 154.39,87.39 154.42,87.73 154.51,88.07 154.66,88.38 154.86,88.66 155.1,88.91 155.39,89.11 155.7,89.25 156.04,89.34 158.77,89.38 156.88,99.29 154.6,106.66 150.53,115.98 145.32,124.71 139.09,132.64 135.52,136.39 23.25,136.39 16.47,128.81 10.71,120.43 6.05,111.39 2.59,101.83 0.36,91.9 0,89.37 2.72,89.35 3.06,89.26 3.06,89.26 3.07,89.25 3.38,89.11 3.66,88.91 3.91,88.66 4.11,88.38 4.25,88.07 4.34,87.73 4.37,71.38 4.34,71.04 4.25,70.7 4.11,70.39 3.91,70.11 3.66,69.86 3.38,69.66 3.07,69.52 2.73,69.43 0,69.39 1.92,59.36 4.24,51.9 8.4,42.47 13.68,33.73 18.44,27.54 25.61,20.14 33.66,13.73 42.47,8.4 51.9,4.25 61.77,1.34 69.39,0 69.42,2.72 69.51,3.06 69.51,3.06 69.51,3.07 69.66,3.38 69.86,3.66 70.11,3.91 70.39,4.11 70.7,4.25 71.04,4.34 87.38,4.37 87.73,4.34 88.07,4.25 88.38,4.11 88.66,3.91
Copper layers (1*2*15*16): Top 0.035mm / dielectric 0.4mm / Route2 0.035mm / dielectric 0.4mm / Route15 0.035mm / dielectric 0.4mm / Bottom 0.035mm
Design rules: minimum track width 8mil, minimum drill 20mil, track to track 8mil, track to pad 8mil, pad to pad 8mil, via to via 8mil, smd to smd 8mil, copper to edge 10mil, drill to drill 8mil, minimum pad ring 12mil, minimum via ring 10mil, stop-mask expansion 4mil, vias tented up to drill 25mil, thermal gap 10mil
tRestrict: area 13,116.8 to 19.4,123.2; area 138.9,116.8 to 145.3,123.2; area 139.1,34.9 to 145.4,41.3; area 13,34.9 to 19.4,41.3; area 109.9,126.5 to 117.8,129.5
bRestrict: area 13,116.8 to 19.4,123.2; area 138.9,116.8 to 145.3,123.2; area 139.1,34.9 to 145.4,41.3; area 13,34.9 to 19.4,41.3

### Footprints (pad centres in the part's own frame; a part is rotated, then mirrored left to right if it is on the bottom)
0805@1 = smd 0.8 x 1.2: 1 -0.9,0; 2 0.9,0
NRF24L01 = drill 1.016 square: CE 2.54,0; CSN 2.54,2.54; GND 0,0; IRQ 7.62,2.54; MISO 7.62,0; MOSI 5.08,2.54; SCK 5.08,0; VCC 0,2.54
SOD-323 = smd 0.63 x 0.83: 1 -1.15,0; 2 1.15,0
RHOBAN_BL_DRIVER = drill 1 pad 1.778: 3.3 17.247,-0.513; CS 12.167,-0.513; GND 22.327,-0.513; GND2 8.01,44.27; GND3 5.47,44.27; GND4 2.93,44.27; MISO 4.547,-0.513; MOSI 7.087,-0.513; SCK 9.627,-0.513; V+1 27.01,44.093; V+2 24.47,44.093; V+3 21.93,44.093; VCC 19.787,-0.513; VDRIVER 14.707,-0.513 | hole 3: 14.9,43.8; 11.7,3.8
JST_ZH_2P = drill 0.7: P$1 1.27,0; P$2 -0.23,0
CONNEC_2X20 = drill 1 pad 1.778: AV+ 0,0; AV- 2.54,0; BUT 5.08,-15.24; GND 2.54,-15.24; RESET 15.24,0; VBAT 5.08,0; VCC 0,-15.24; VIN 48.26,0; X0 45.72,0; X1 43.18,0; X2 40.64,0; X3 38.1,0; X4 35.56,0; X5 33.02,0; X6 30.48,0; X7 27.94,0; X8 25.4,0; X9 22.86,0; X10 20.32,0; X11 17.78,0; X12 12.7,0; X13 10.16,0; X14 7.62,0; X15 7.62,-15.24; X16 10.16,-15.24; X17 12.7,-15.24; X18 15.24,-15.24; X19 17.78,-15.24; X20 20.32,-15.24; X21 22.86,-15.24; X22 25.4,-15.24; X23 27.94,-15.24; X24 30.48,-15.24; X25 33.02,-15.24; X26 35.56,-15.24; X27 38.1,-15.24; X28 40.64,-15.24; X29 43.18,-15.24; X30 45.72,-15.24; X31 48.26,-15.24
R0805 = smd 1.3 x 1.5: 1 -0.95,0; 2 0.95,0
0805 = smd 0.8 x 1.2: 1 -0.9,0; 2 0.9,0
TRACOPOWER = drill 0.8 square: P$1 3.5,2; P$2 6.04,2; P$3 8.58,2
SO8 = smd 1.981 x 0.533: 1 -2.464,1.905; 2 -2.464,0.635; 3 -2.464,-0.635; 4 -2.464,-1.905; 5 2.464,-1.905; 6 2.464,-0.635; 7 2.464,0.635; 8 2.464,1.905
SOT-23 = smd 1 x 1.4: 1 -0.95,-1.1; 2 0.95,-1.1; 3 0,1.1
SOIC127P600X175-16N = smd 1.981 x 0.559: 1 -2.464,4.445; 2 -2.464,3.175; 3 -2.464,1.905; 4 -2.464,0.635; 5 -2.464,-0.635; 6 -2.464,-1.905; 7 -2.464,-3.175; 8 -2.464,-4.445; 9 2.464,-4.445; 10 2.464,-3.175; 11 2.464,-1.905; 12 2.464,-0.635; 13 2.464,0.635; 14 2.464,1.905; 15 2.464,3.175; 16 2.464,4.445
GY-85 = drill 1.016 pad 1.778 square: 3.3 0,15.24; A_INT1 0,2.54; G_INT 0,0; GND 0,12.7; M_DRDY 0,5.08; SCL 0,10.16; SDA 0,7.62; VCC_IN 0,17.78 | hole 4: 12.9,17
PANASONIC_D = smd 3 x 1.4: + 2.4,0; - -2.4,0
PANASONIC_D8 = smd 4.016 x 0.8: + 2.73,0; - -2.73,0
BUZZER66 = drill 1 square: P$1 -3.3,0; P$2 3.3,0
STAND-OFF = hole 3.302: 0,0
SRB22A2FBBNN = smd 3.81 x 7.62: P$1 9.5,-3.8; P$2 1.9,-3.8
JST-XH-07-PACKAGE-LONG-PAD = drill 1.016 long: 1 -7.62,0; 2 -5.08,0; 3 -2.54,0; 4 0,0; 5 2.54,0; 6 5.08,0; 7 7.62,0
XT60 = drill 4.8 square: GND 11.5,4; V+ 4.5,4

### Placement (x,y rotation side)
C1  74.17,45.71 270 bottom
C2  57.41,45.99 270 bottom
C3  83.61,124.84 270 top
C4  105.84,32.57 90 top
C5  44.31,38.94 90 bottom
C6  69.08,38.86 90 bottom
C7  100.55,68.21 0 top
C8  93.84,38.78 90 bottom
C9  119.75,39.21 90 bottom
C10  96.28,33.04 90 top
C11  58.03,32.2 90 bottom
C12  71.9,17.01 90 top
C13  17.9,86.77 0 top
C14  141.19,72.2 180 top
C15  98.87,28.05 90 top
COM1  18.73,82.53 270 bottom
COM2  140.02,74.91 90 bottom
COM3  75.25,18.4 180 bottom
D1  124.04,75.85 0 top
D2  29.31,68.29 180 top
D3  26.61,81.35 180 top
D4  67.04,58.59 270 top
D5  123.95,78.94 0 top
DRIVER1  108.32,83.77 0 top
DRIVER2  137.69,72.11 180 top
DRIVER3  51.01,71.18 180 top
DRIVER4  21.21,78.86 0 top
DRIVER5  52.36,63.14 0 top
EMIT  143.36,112.82 180 top
MAPLE  103.89,126.16 270 top
R1  115.26,35.25 180 bottom
R2  90.31,34.85 180 bottom
R3  65.43,34.65 180 bottom
R4  146.04,102.44 90 top
R5  141.86,108.03 90 top
R6  15.9,108.92 0 top
R7  40.46,35.18 180 bottom
R8  46.31,22.58 0 top
R10  92.98,44.57 0 top
R11  87.92,44.59 0 top
R20  101.46,34.45 90 top
R21  103.54,34.41 270 top
RECEIVE  15.27,112.73 0 top
REG3.3V  52.68,39.25 270 top
REG3.3V1  52.52,53.22 270 top
REG5V  69.05,52.86 270 top
SENSE  103.51,26.57 90 top
T2  146.62,108.38 0 top
U1  89.41,34.58 270 top
U$1  115.38,38.88 0 bottom
U$2  86.4,65.12 270 top
U$3  64.39,32.78 270 top
U$4  80.75,46.24 270 top
U$5  90.38,38.88 0 bottom
U$6  64.48,47.06 270 top
U$7  14.63,90.93 180 top
U$8  139.9,66.2 90 top
U$9  66.38,16.98 270 top
U$10  65.38,38.88 0 bottom
U$11  40.38,38.88 0 bottom
U$12  44.47,18 180 top
U$13  53.36,14.76 0 top
U$14  [STAND-OFF]  16.19,120 0 top
U$15  55.78,122.34 0 top
U$16  [STAND-OFF]  142.12,120 0 top
U$17  [STAND-OFF]  142.12,38.08 0 top
U$18  [STAND-OFF]  16.19,38.08 0 top
X2  99.38,17.86 180 top
XT60  44.64,134.93 180 top

### Tracks (layer width: path | path; a pad name or v marks a point on that pad's centre or on a via)
+3V3  (via drill 0.6)
  Top 0.406: U1.16 96.26,32.12 C10.1 95.7,32.14 v95.7,30.46 95.7,29.7 90.62,24.62 v89.6,24.62 | 33.72,71.74 DRIVER3.3.3 | DRIVER2.3.3 120.45,76.04 121.6,77.2 123.13,77.2 123.89,77.96 123.89,79.99 125.41,81.52 125.41,83.3 | 125.41,83.55 125.41,83.3 | 125.41,83.3 125.67,83.04 125.67,83.16 DRIVER1.3.3 | 11.9,92.95 11.9,93.23 | 38.55,78.44 DRIVER4.3.3 | 63.44,23.61 63.44,16.75 66.23,13.95 66.49,14.21 66.74,14.46 | 72.07,14.25 U$9.+ 66.74,13.9 66.74,13.45 65.43,14.76 U$13.P$2 | 72.07,14.25 73.64,14.25 COM3.VCC | C12.1 71.9,14.43 72.07,14.25 | U$8.+ 140.77,68.93 141.92,70.09 141.92,72.03 C14.1
  Top 0.61: COM1.VCC 16.19,85.97 C13.1 | DRIVER4.3.3 38.46,76.61 36.77,74.91 34.74,74.91 33.72,73.9 33.72,71.74 | U$3.+ 54.97,30.38 REG3.3V.P$3 | U$7.+ 11.9,92.95 14.95,96 R6.1 | 11.9,93.23 12.13,93.46 32.2,93.46 38.55,87.11 38.55,78.44 | COM2.VCC 142.56,72.67 C14.1 | MAPLE.AV+ MAPLE.VCC | MAPLE.VCC 84.21,126.16 | C3.1 84.03,126.16 84.21,126.16 | v89.6,24.62 73.6,24.62 69.28,24.62 64.45,29.45 64.45,30.21 | v66.49,94.22 66.49,72.12 v71.82,66.79 | U$9.+ 66.44,14.25 66.49,14.21 | 64.71,30.46 64.37,30.21 64.45,30.21 | v70.8,37.58 70.8,32.24 68.77,30.21 64.45,30.21 | 64.45,30.21 64.45,30.32 U$3.+ | 63.44,23.61 63.44,29.42 U$3.+ | 84.21,126.16 84.27,126.22 88.59,126.22 MAPLE.VCC | 64.45,30.21 64.2,30.46
  Top 0.813: C7.2 101.45,67.89 101.79,67.55 101.79,65.27 U$2.3.3
  Top 1.422: COM1.VCC 14.54,82.53 12,85.07 12,90.84 U$7.+
  Route15 0.406: 33.72,71.64 DRIVER3.3.3 | v120.33,64.25 120.33,72.37 120.45,72.49 DRIVER2.3.3
  Route15 0.61: DRIVER5.3.3 69.61,61.27 68.77,60.44 38.29,60.44 33.72,65.01 33.72,71.64 | v70.8,37.58 72.07,37.58 75.12,40.62 75.12,59.93 77.15,61.96 77.15,65.52 75.88,66.79 v71.82,66.79 | MAPLE.AV+ 82.18,126.16 71.31,115.3 71.31,99.04 v66.49,94.22
  Bottom 0.406: 69.79,62.81 DRIVER5.3.3 | v45.91,37.83 44.64,37.83 | U$5.1 93.74,37.78 94.13,37.78 94.17,37.83 93.92,37.83 | 91.38,37.58 91.38,34.97 R2.2 91.32,34.78 92.9,34.78 | 101.64,63.33 101.54,63.23 | COM2.VCC 142.56,71.73 | v120.33,64.25 139.89,64.25 142.56,66.91 142.56,71.73 | C6.1 70.67,37.96 71.06,37.58 | R1.2 116.21,37.51 116.27,37.58 118.81,37.58 119.57,38.34 119.57,26.65 117.79,24.88 91.38,24.62 v89.6,24.62 | 142.56,71.73 C14.1
  Bottom 0.61: R7.2 41.33,35.25 U$11.1 41.59,38.04 C5.1 44.43,38.04 44.64,37.83 | R3.2 66.33,34.7 U$10.1 66.51,37.96 C6.1 70.42,37.96 v70.8,37.58 | R2.2 91.26,37.71 U$5.1 | 93.74,37.78 C8.1 | R1.2 116.21,37.66 U$1.1 119.22,37.78 C9.1 | v120.33,64.25 112.46,64.25 111.44,63.23 101.54,63.23 84.01,63.23 80.46,66.79 v71.82,66.79 71.57,66.79 69.79,65.01 69.79,62.81 | C11.1 58.03,30.89 57.34,30.21 55.14,30.21 REG3.3V.P$3 54.22,30.21 52.52,30.21 45.91,36.81 v45.91,37.83 | U$2.3.3 101.64,63.33 | 92.9,34.78 94.17,34.78 95.7,33.26 v95.7,30.46
+12V  (via drill 0.6)
  Top 0.406: 28.14,68.31 D2.2 | D1.2 125.19,78.86 D5.2 | 28.16,66.56 v28.13,66.53 | 66.99,57.4 D4.2 | v66.99,44.43 64.45,44.43 | 64.45,44.43 64.2,44.69 64.45,44.69 64.45,44.43 | 64.45,44.64 U$6.+
  Top 0.61: D3.2 23.65,81.35 23.05,80.76 23.05,74.41 26.35,71.1 26.35,69.33 27.37,68.31 28.14,68.31 | D2.2 28.16,66.56 | v66.99,54.09 66.99,57.4 | D1.2 125.19,79.01 125.92,79.74 131,79.74 136.08,74.66 136.08,65.52 132.27,61.71 v132.27,54.59 | REG3.3V1.P$3 64.45,44.64 | U$6.+ 64.45,44.69
  Route15 0.406: X2.3 v101.92,47.61 101.79,47.74
  Route15 0.61: v28.13,66.53 28.13,61.45 34.48,55.1 65.98,55.1 v66.99,54.09
  Bottom 0.406: C2.2 54.97,45.09 REG3.3V1.P$3 | 103.32,47.74 102.05,47.74 v101.92,47.61
  Bottom 0.61: v132.27,54.59 122.11,54.59 115.25,47.74 103.32,47.74 89.85,47.74 83,53.83 67.5,53.83 v66.99,54.09 v66.99,44.43
ADDR1  (via drill 0.6)
  Top 0.406: MAPLE.X14 99.96,118.54 99.25,117.84 99.25,73.9 106.87,66.28 106.87,47.48 105.35,45.96 v104.59,45.96 | U1.11 87.51,33.57 86.55,34.53 84.27,34.53 83.5,35.29 83.5,38.85 84.27,39.61 v86.81,39.61
  Bottom 0.406: v86.81,39.61 86.81,40.62 88.08,41.89 103.57,41.89 104.59,42.91 v104.59,45.96
ADDR2  (via drill 0.6)
  Top 0.406: U1.10 86.3,32.06 v86.3,29.96
  Route15 0.406: v79.95,78.22 79.95,62.47 85.28,57.13 85.28,30.97 v86.3,29.96
  Bottom 0.406: v79.95,78.22 80.71,78.22 81.47,77.45 88.33,77.45 88.84,77.96
  Bottom 0.61: 88.84,77.96 88.71,77.96 MAPLE.X31
ADDR3  (via drill 0.6)
  Top 0.406: U1.9 84.97,32.44 | MAPLE.X2 101.99,85.52 101.79,85.33 101.79,75.93 110.17,67.55 110.17,46.21 107,43.04 v100.65,43.04 | 84.97,32.81 84.97,32.44 | 84.97,32.44 84.77,32.24 83.76,32.24 82.49,33.51 82.49,41.64 v83.76,42.91
  Bottom 0.406: v83.76,42.91 100.78,42.91 v100.65,43.04
BAT
  Top 0.406: 91.89,44.43 91.73,44.59 R11.2 88.78,44.5 U1.5 | 91.89,44.69 91.89,44.43 | 91.89,44.43 91.9,44.43 R10.1
BOOST_EN
  Route15 0.406: X2.4 99.38,48.88 84.77,63.48 84.77,69.58 91.63,76.44 91.63,87.36 90.87,88.12 88.71,88.12 MAPLE.X27
BUZZER  (via drill 0.6)
  Top 0.61: R8.2 49.72,22.59 v50.23,23.1
  Bottom 0.61: v50.23,23.1 124.14,23.1 126.18,25.13 126.18,31.48 149.54,54.85 149.54,89.9 131,108.44 103.95,108.44 MAPLE.X11
CAP
  Top 0.406: U1.1 97.2,37.05 | 97.2,37.05 97.22,37.05 98.24,36.03 98.24,30.46 94.68,26.91 94.68,25.76 91.76,22.84 X2.7 | 97.2,37.05 97.22,37.07
CHARGE_CUR
  Top 0.406: U1.2 92.59,38.28 93.16,38.85 100.52,38.85 101.28,38.08 101.28,35.52 R20.2 101.51,35.29 103.57,35.29 R21.1
COM_CE1  (via drill 0.6)
  Top 0.61: 18.99,80.25 COM1.CE
  Route15 0.406: v21.53,103.11 21.53,81.01 20.26,79.74 18.99,79.74 COM1.CE
  Bottom 0.406: MAPLE.X13 101.85,116 101.03,116.82 101.03,128.25 98.24,131.05 66.74,131.05 48.71,113.01 31.43,113.01 v21.53,103.11
COM_CE2  (via drill 0.6)
  Top 0.61: COM2.CE 136.84,77.45 v134.05,80.25
  Bottom 0.61: v134.05,80.25 109.41,80.25 106.11,83.55 106.11,86.85 105.09,87.87 102.81,87.87 MAPLE.X3
COM_CE3  (via drill 0.6)
  Route15 0.406: v108.9,21.57 108.9,100.82 106.62,103.11 103.82,103.11 103.82,103.36
  Route15 0.813: 103.82,103.36 103.83,103.36 MAPLE.X9
  Bottom 0.406: COM3.CE 77.79,20.43 78.93,21.57 v108.9,21.57
CS_COM_1
  Bottom 0.61: MAPLE.X20 85.73,105.84 83.76,103.87 83.76,103.11 80.71,100.06 17.72,100.06 13.4,95.74 13.4,79.99 COM1.CSN
CS_COM_2  (via drill 0.6)
  Top 0.61: MAPLE.X21 91.44,103.3 92.39,102.35 v92.39,69.83
  Route15 0.406: v122.87,62.72 v122.87,69.07
  Bottom 0.406: 142.69,77.45 144.21,77.45 144.72,76.95 144.72,65.01 142.43,62.72 v122.87,62.72 | v122.87,69.07 122.11,69.83 v92.39,69.83
  Bottom 0.61: 142.69,77.45 COM2.CSN
CS_COM_3
  Route15 0.406: COM3.CSN 77.79,12.81 79.69,10.91 85.79,10.91 86.81,11.92 86.81,24.62 80.71,30.72 80.71,59.67 78.17,62.21 78.17,95.74 83.25,100.82 88.59,100.82 MAPLE.X22
DRIVERS_CS1
  Bottom 0.61: MAPLE.X7 102.68,98.28 111.44,98.28 116.52,93.2 116.52,86.6 117.79,85.33 120.08,85.33 120.49,84.92 DRIVER1.CS
DRIVERS_CS2
  Top 0.406: DRIVER2.CS 125.53,71.22 124.91,70.6 111.44,70.6 110.43,71.61 110.43,82.03 109.67,82.79 104.08,82.79 MAPLE.X1 | MAPLE.X1 103.82,83.04 | MAPLE.X1
DRIVERS_CS3  (via drill 0.6)
  Top 0.61: MAPLE.X19 85.22,108.38 84.27,107.43 84.27,88.38 73.34,77.45 v73.34,71.1
  Bottom 0.61: v73.34,71.1 56.33,71.1 54.55,69.33 42.86,69.33 42.1,70.09 40.45,70.09 DRIVER3.CS
DRIVERS_CS4  (via drill 0.6)
  Top 0.61: v82.74,90.41 82.74,108.95 84.77,110.98 88.59,110.98 MAPLE.X18
  Bottom 0.61: v82.74,90.41 73.34,81.26 36.3,81.26 DRIVER4.CS
DRIVERS_CS5
  Route15 0.406: MAPLE.X17 83.7,113.46 82.49,112.25 82.49,106.16 71.31,94.98 71.31,69.58 66.23,64.5 65.22,64.5 64.45,63.74 64.45,62.72 64.71,62.47 64.69,62.47 DRIVER5.CS
DRIVERS_MISO  (via drill 0.6)
  Top 0.406: DRIVER1.MISO 112.87,75.77 v112.97,75.68 | DRIVER5.MISO 56.91,63.81 59.12,66.02 59.12,72.88 v59.88,73.64
  Bottom 0.406: DRIVER4.MISO 25.76,75.76 28.13,73.64 46.17,73.64 46.42,73.39 46.42,73.14 | 46.42,73.14 46.42,71.61 | DRIVER3.MISO 46.47,73.09 | 46.47,73.09 46.42,73.14 | 46.47,73.09 46.47,73.44 46.67,73.64 v59.88,73.64 75.63,73.64 77.41,71.87 108.9,71.87 112.71,75.68 v112.97,75.68 132.27,75.68 133.03,74.91 133.03,72.74 DRIVER2.MISO
  Bottom 0.61: MAPLE.X5 102.68,93.2 108.9,93.2 112.87,89.24 DRIVER1.MISO
DRIVERS_MOSI  (via drill 0.6)
  Top 0.406: DRIVER3.MOSI 43.93,74.61 | 43.93,74.61 v43.88,74.91 43.93,74.87 43.93,74.61 | v130.49,76.95 130.49,72.74 DRIVER2.MOSI | DRIVER1.MOSI 115.41,77.04 v115.51,76.95 | DRIVER5.MOSI 59.45,64.57 60.39,65.52 60.39,71.36 61.91,72.88 v61.91,74.91
  Top 0.61: DRIVER1.MOSI 115.41,86.44 111.44,90.41 103.69,90.41 | 102.55,90.66 102.81,90.66 103.06,90.41 103.69,90.41 | 103.69,90.41 MAPLE.X4
  Bottom 0.406: DRIVER4.MOSI 28.39,78.27 28.39,76.44 30.16,74.91 v43.88,74.91 v61.91,74.91 75.88,74.91 77.66,73.14 107.63,73.14 111.44,76.95 v115.51,76.95 v130.49,76.95
DRIVERS_SCK  (via drill 0.6)
  Top 0.406: DRIVER3.SCK 41.39,75.88 | 41.39,75.88 v41.34,76.18 41.39,76.14 41.39,75.88 | v127.95,78.22 127.95,72.88 128.21,72.63 DRIVER2.SCK | 127.95,72.63 DRIVER2.SCK | DRIVER2.SCK | v118.05,78.22 118.05,83.3 117.99,83.3 DRIVER1.SCK | DRIVER5.SCK 61.99,64.68 61.66,65.01 61.66,70.09 63.44,71.87 v63.44,76.18
  Bottom 0.406: DRIVER4.SCK 30.93,78.27 30.93,76.95 31.69,76.18 v41.34,76.18 v63.44,76.18 76.14,76.18 77.92,74.41 106.62,74.41 110.43,78.22 v118.05,78.22 v127.95,78.22 | DRIVER1.SCK 117.95,83.39
  Bottom 0.61: MAPLE.X6 103.07,95.23 110.94,95.23 114.49,91.68 114.49,86.85 117.95,83.39
GND  (via drill 0.6)
  Top 0.61: COM1.GND 18.73,86.71 C13.2 18.8,89.5 U$7.- | R21.2 105.8,33.51 C4.2 106.91,33.47 107.38,33 107.38,29.96 106.36,28.94 105.51,28.94 SENSE.5 105.35,28.96 105.35,27.67 104.83,27.15 C15.1 103.07,27.15 v103.57,26.65 | U$3.- 61.8,35.18 59.63,33 54.89,33 REG3.3V.P$2 | U$6.- 63.13,49.46 60.64,46.97 54.72,46.97 REG3.3V1.P$2 | REG5V.P$2 71.15,46.72 76.39,46.72 78.31,48.64 U$4.- 80.89,48.5 85.54,48.5 86.97,47.07 R11.1 | 90.11,35.04 89.6,35.04 87.51,35.04 U1.6 U1.7 U1.8 84.97,37.07 | 90.11,35.04 90.11,37.05 U1.4 | v42.86,39.86 43.12,39.86 | T2.2 148.64,107.28 v149.04,107.43 | C14.2 140.29,74.64 COM2.GND | U$12.2 42.29,19.1 v42.1,19.29 | 95.19,35.04 90.11,35.04 | 72.07,18.02 72.01,18.02 | C7.1 99.65,68.17 99.76,68.31 | 95.44,35.29 v95.7,35.29 | 139.89,63.74 v139.89,60.69 139.89,63.46 U$8.-
  Top 0.813: MAPLE.AV- MAPLE.GND 83.82,123.62 83.61,123.84 | U$9.- 70.38,19.71 72.07,18.02 | COM3.GND 72.39,18.4 C12.2 72.01,18.02 | C10.2 96.28,35.21 96.2,35.29 v95.7,35.29 | 95.44,35.29 95.19,35.04 | U$2.GND 99.1,67.65 99.76,68.31 | 83.61,123.84 83.5,123.94 | C3.2 83.61,123.84
  Route2 0.61: 138.62,71.61 138.62,61.96 v139.89,60.69
  Bottom 0.61: U$11.3 43.12,39.98 | 43.12,39.98 44.01,39.98 44.26,39.74 v42.86,39.86 | U$10.3 68.85,39.98 C6.2 69.08,39.81 69.03,39.86 v67.25,39.86 | U$5.3 93.54,39.98 C8.2 93.92,39.61 94.93,39.61 v95.7,40.37 | 115.08,39.68 U$1.3 | REG3.3V.P$2 54.73,33.26 54.8,33.26 54.96,33.1 C11.2 58.03,33.08 58.1,33 58.36,33.26 | C2.1 54.81,46.89 REG3.3V1.P$2 | C1.1 71.26,46.61 REG5V.P$2 | C5.2 43.12,39.84 43.12,39.98 | v111.7,42.91 111.7,41.13 112.97,39.86 115.26,39.86 U$1.3 | U$1.3 119.62,39.98 C9.2 | v42.1,19.29 41.85,19.29 41.59,19.54 | v103.57,26.65 103.82,26.65
  other vias: 92.9,108.44 80.2,92.69 84.01,85.33 19.24,50.53 9.34,50.53 8.57,72.88 9.08,104.12 153.61,65.26 153.35,95.74 64.45,7.86 84.77,7.35 105.35,7.6 114.49,104.89 126.68,88.12 66.23,102.09 74.87,102.35 62.17,84.57 73.85,84.82 114.24,52.31 98.74,52.05 90.11,50.28 87.06,54.34 61.91,49.77 82.74,49.77 62.42,35.8 104.08,38.34
  pour Route2 (no thermals): -3.87,137.65 163.01,137.91 164.02,-6.62 -2.86,-6.87
  pour Bottom (isolate 0.406): -3.36,143.75 142.69,143.75 163.01,123.43 163.01,39.35 119.32,-4.33 34.99,-4.33 -3.87,34.53 -3.87,143.24
  pour Route15 (isolate 0.406): 15.94,140.95 136.84,140.95 161.99,115.81 161.99,18.53 144.72,1.25 141.42,-2.05 27.37,-2.05 -2.09,27.42 -2.09,122.92
  pour Top (isolate 0.406): 20,139.43 36.01,139.43 36.01,106.92 44.9,98.03 44.9,71.1 20,46.21 20,23.1 22.29,20.81 34.48,20.81 36.51,22.84 36.51,40.62 60.14,64.25 60.14,98.54 64.71,103.11 80.2,103.11 82.49,105.39 82.49,126.22 83.5,127.24 104.08,127.24 105.6,125.71 105.6,119.62 107.13,118.09 115.25,118.09 116.52,116.82 116.52,101.33 134.81,83.04 142.43,83.04 142.43,61.2 138.37,57.13 123.64,57.13 106.36,39.86 106.36,28.94 104.33,26.91 100.78,26.91 99,25.13 99,18.78 103.32,14.46 108.4,14.46 134.3,40.37 150.81,40.37 153.61,37.58 153.61,-2.56 150.31,-5.86 18.23,-5.86 -4.63,17 -4.63,114.79
HALL1  (via drill 0.6)
  Top 0.406: U1.13 90.05,28.88 89.35,28.18 v89.35,27.16
  Bottom 0.406: v89.35,27.16 95.44,27.16 100.27,31.99 111.04,31.99 R1.1
  Bottom 0.61: R1.1 114.31,37.66 U$1.2
HALL2  (via drill 0.6)
  Top 0.406: U1.14 91.32,29.64 v91.38,29.7
  Bottom 0.406: v91.38,29.7 90.11,29.7 89.35,30.46 R2.1
  Bottom 0.61: R2.1 89.36,37.71 U$5.2
HALL3  (via drill 0.6)
  Top 0.406: U1.15 92.59,28.49 v92.65,28.43
  Bottom 0.406: v92.65,28.43 64.96,28.43 64.45,28.94 64.45,34.62 R3.1
  Bottom 0.61: R3.1 64.48,37.73 U$10.2
HALL4  (via drill 0.6)
  Top 0.406: v87.57,27.16 87.57,28.18 88.84,29.45 88.84,32.06 U1.12
  Bottom 0.406: R7.1 39.51,32.04 39.56,31.99 39.56,31.23 40.58,30.21 49.47,30.21 52.52,27.16 v87.57,27.16
  Bottom 0.61: R7.1 39.51,37.71 U$11.2
IMU_SCL
  Top 0.61: U$2.SCL 96.56,111.39 92.14,115.81 88.84,115.81 MAPLE.X16
IMU_SDA
  Route15 0.406: U$2.SDA 94.02,68.67 96.97,71.61 96.97,114.54 92.9,118.6 88.84,118.6 88.58,118.86 88.58,118.6
  Route15 0.61: 88.58,118.6 88.59,118.6 MAPLE.X15
IR_EMIT  (via drill 0.6)
  Top 0.61: v149.8,101.33 146.24,101.33 146.13,101.33 R4.1
  Bottom 0.61: MAPLE.X12 137.04,113.46 v149.8,101.33
IR_RECEIVE  (via drill 0.6)
  Top 0.61: RECEIVE.P$1 16.54,111.15 16.96,110.73 16.96,109.02 R6.2 17.65,109.71 v31.18,109.71
  Bottom 0.61: MAPLE.X10 101.6,105.84 99,108.44 99,127.75 96.97,129.78 80.2,129.78 76.39,125.97 66.23,115.3 61.41,110.47 31.94,110.47 v31.18,109.71
IRQ1  (via drill 0.6)
  Top 0.61: v24.07,70.09 18.48,70.09 16.19,72.37 COM1.IRQ
  Bottom 0.61: MAPLE.X23 27.31,98.22 24.07,94.98 v24.07,70.09
IRQ2  (via drill 0.6)
  Top 0.61: MAPLE.X24 90.17,95.68 90.87,94.98 90.87,69.58 v89.35,68.06
  Bottom 0.406: 142.94,82.79 142.94,84.06 142.43,84.57 138.11,84.57 136.84,83.3 136.84,68.82 133.8,65.77 112.97,65.77 110.68,68.06 v89.35,68.06 89.35,67.8
  Bottom 0.61: 142.94,82.79 142.81,82.79 COM2.IRQ
IRQ3  (via drill 0.6)
  Route15 0.406: 104.08,80.25 103.82,80.5 105.86,80.5 106.87,79.49 106.87,21.83 110.68,18.02 v110.68,14.97
  Route15 0.61: 103.82,80.5 103.83,80.5 MAPLE.X0
  Bottom 0.406: COM3.IRQ 84.39,15.86 85.28,14.97 v110.68,14.97
KICK1  (via drill 0.6)
  Route15 0.406: X2.5 96.84,49.64 83.76,62.72 v83.76,70.09 | v87.57,69.83 94.17,76.44 94.17,91.17 92.14,93.2 88.71,93.2 MAPLE.X25
  Bottom 0.406: v83.76,70.09 87.31,70.09 v87.57,69.83
KICK2
  Route15 0.406: X2.6 94.3,49.89 82.11,62.09 81.73,62.47 81.73,85.58 86.75,90.6 MAPLE.X26
MISO  (via drill 0.6)
  Top 0.406: v78.17,57.64 78.17,71.61 83,76.44 v83,78.72
  Route15 0.406: COM2.MISO 137.61,82.53 136.08,81.01 v136.08,57.64 | v83,78.72 83,80.5 85.54,83.04 88.59,83.04 MAPLE.X29 | COM3.MISO 82.87,21.45 78.17,26.15 v78.17,57.64
  Bottom 0.406: COM1.MISO 18.73,59.93 21.02,57.64 v78.17,57.64 v136.08,57.64
MOSI  (via drill 0.6)
  Top 0.406: v79.44,56.12 79.44,70.09 85.03,75.68 v85.03,78.72
  Route15 0.406: v79.44,56.12 79.44,27.42 85.28,21.57 85.28,14.46 84.52,13.7 81.22,13.7 80.46,14.46 80.46,15.73 COM3.MOSI
  Bottom 0.406: COM1.MOSI 14.16,77.45 13.4,76.69 13.4,58.15 15.43,56.12 v79.44,56.12 144.72,56.12 146.24,57.64 146.24,78.47 144.72,79.99 COM2.MOSI | v85.03,78.72 85.03,83.8 86.81,85.58 88.59,85.58 MAPLE.X28
MUX
  Top 0.406: U1.3 91.32,38.79 91.38,38.85 91.38,39.61 93.66,41.89 94.93,41.89 97.47,44.43 105.86,44.43 108.14,46.72 108.14,67.29 100.78,74.66 100.78,99.55 101.99,100.76 MAPLE.X8
N$1
  Top 1.27: XT60.V+ 53.77,130.93 58.36,126.35 58.36,120.89 58.49,120.76
  pour Top (no thermals): 37.15,134.99 60.64,134.99 60.64,114.54 54.55,114.54 54.55,125.21 52.77,126.98 37.15,126.98
N$2
  Top 0.406: C4.1 104.52,31.67 104.08,31.23 104.08,29.1 SENSE.6
N$3
  Top 0.406: R8.1 45.36,19.08 | 45.36,19.08 45.66,18.78 45.4,18.78 | 45.36,19.08 45.38,19.1 U$12.1
N$4
  Top 0.406: 102.3,23.41 SENSE.1
  Top 0.61: X2.2 104.46,20.43 102.3,22.59 102.3,23.41 | SENSE.2 SENSE.1
  pour Top (no thermals): 105.35,17 105.35,20.3 103.06,22.59 103.06,25.13 101.28,25.13 101.28,22.08 103.57,19.8 103.57,17
N$5
  Top 0.406: U$12.3 47.92,16.9 U$13.P$1
N$6
  Top 0.61: R5.2 141.86,112.59 EMIT.P$1
N$7
  Top 0.61: EMIT.P$2 145.16,112.82 146.75,111.24 146.75,109.62 T2.3
N$8
  Top 0.406: 122.8,82.97 123.09,83.25 | 122.87,83.3 123.13,83.3 123.09,83.25 | DRIVER1.VDRIVER 123.09,83.25
  Top 0.61: D5.1 122.8,82.97
N$9
  Top 0.61: DRIVER4.VDRIVER 35.92,79.57 35.24,80.25 28.86,80.25 D3.1
N$10
  Top 0.406: 67.07,59.77 D4.1
  Top 0.61: DRIVER5.VDRIVER 67.07,59.77
N$11
  Top 0.61: T2.1 145.67,107.61 145.73,107.43 145.73,103.44 R4.2
N$12
  Top 0.406: 30.47,68.31 D2.1
  Top 0.61: DRIVER3.VDRIVER 36.31,69.88 34.74,68.31 30.47,68.31
N$13
  Top 0.406: 122.99,75.75 D1.1
  Top 0.61: DRIVER2.VDRIVER 122.99,75.75
N$24
  Top 0.406: SENSE.7 102.88,30.9 101.54,32.24 101.54,33.47 R20.1
SCK  (via drill 0.6)
  Top 0.406: v76.65,59.42 76.65,77.45 79.44,80.25 88.45,80.25 MAPLE.X30
  Route15 0.406: COM2.SCK 138.62,79.99 137.86,79.23 v137.86,59.42 | v76.65,59.42 76.65,25.13 80.46,21.32 80.46,18.27 | 80.46,18.02 80.46,18.27 | COM3.SCK 80.46,18.27
  Bottom 0.406: COM1.SCK 20.51,77.45 21.27,76.69 21.27,61.2 23.05,59.42 v76.65,59.42 v137.86,59.42
V+
  Top 0.61: REG3.3V.P$1 53.58,35.75 51.75,37.58 51.75,48.5 | 51.75,48.5 53.02,49.77 54.47,49.77 REG3.3V1.P$1 | R10.2 94.17,44.81 94.17,49.77 91.38,52.56 70.55,52.56 | 70.55,52.56 51.75,52.56 | 51.75,52.56 39.82,52.56 39.56,52.82 36.26,52.82 25.85,42.4 25.85,27.67 26.35,27.16 26.35,26.91 | REG5V.P$1 71.05,52.07 70.55,52.56 | 51.75,48.5 51.75,52.56 | R5.1 136.43,107.08 136.34,107.17 136.34,124.32 DRIVER1.V+2 | DRIVER2.V+1 106.77,24.1 SENSE.4 SENSE.3
  Top 1.422: DRIVER5.V+3 DRIVER5.V+2 | DRIVER2.V+3 DRIVER2.V+2 DRIVER2.V+1
  pour Top (no thermals): 40.83,125.46 51.75,125.46 53.02,124.19 53.02,113.27 62.17,113.27 62.17,125.21 80.2,125.21 80.96,124.44 80.96,105.39 71.57,105.39 71.57,109.2 40.83,109.2
  pour Top (no thermals): 62.42,116.82 80.96,116.82 80.96,126.73 82.49,128.25 106.87,128.25 106.87,120.38 138.88,120.38 138.88,129.27 135.07,135.11 62.17,135.11 62.17,117.08
  pour Top (no thermals): 21.78,25.13 21.78,44.69 48.2,70.6 48.2,99.04 40.83,106.41 40.83,109.97 53.79,109.97 53.79,106.16 58.1,101.84 58.1,66.53 33.72,42.15 33.72,25.13
  pour Top (no thermals): 118.05,129.52 118.05,102.35 135.83,84.57 143.7,84.57 144.46,83.8 144.46,60.44 136.84,52.82 123.38,52.82 108.65,38.08 108.65,26.4 108.9,26.15 118.05,26.15 118.05,30.97 129.73,42.66 141.92,42.66 153.61,54.34 153.61,89.9 147,96.5 144.97,96.5 138.88,102.6 138.88,129.27
  pour Top (no thermals): 104.08,25.38 107.38,25.38 108.65,26.65 113.48,26.65 113.48,23.1 104.08,23.1
VCC  (via drill 0.6)  (1 unrouted)
  Top 0.61: SENSE.8 98.95,29.03 C15.2 99.26,28.95 v100.52,28.94 | 71.49,43.84 U$4.+ 80.75,28.39 v83.25,25.89 | 71.49,43.84 71.31,43.84 71.06,44.18 71.31,43.93 71.57,43.93 | 71.49,43.84 REG5V.P$3
  Route15 0.61: DRIVER4.VCC 41,77.62 39.56,76.18 32.45,76.18 31.18,74.91 31.18,71.74 DRIVER3.VCC 31.18,71.64 31.18,63.74 36.01,58.91 71.06,58.91 | DRIVER1.VCC 128.21,83.16 128.21,81.26 124.14,77.2 120.08,77.2 117.91,75.03 DRIVER2.VCC 117.91,62.86 v118.05,62.72 | DRIVER5.VCC 72.15,60 71.06,58.91 | 71.06,58.91 71.31,58.91 73.6,56.63 73.6,45.45 72.33,44.18 71.57,44.18 | 71.31,44.02 REG5V.P$3
  Bottom 0.61: v118.05,62.72 117.29,61.96 82.49,61.96 78.93,65.52 73.6,65.52 72.33,64.25 72.33,62.81 DRIVER5.VCC | 71.06,44.18 71.69,44.81 C1.2 74.04,44.94 71.82,44.94 71.16,44.28 REG5V.P$3 | v83.25,25.89 97.47,25.89 v100.52,28.94

### Text on the board
tPlace: RHOBAN SSL rev1 | MAIN | SWITCH | SHORT | LONG | LONG | SHORT | IR EMIT | IR RCV | COM1 | COM3 | COM2 | KICKER
tSilk: 1 | 4 | 5 | 3 | 2
_tsilk: DRIVER | DRIVER | DRIVER | DRIVER | DRIVER | 12V | 5V | 3.3V
_bsilk: 4 | 3 | 2 | 1